# EAGLE design module (EAGLE 7.7.0)
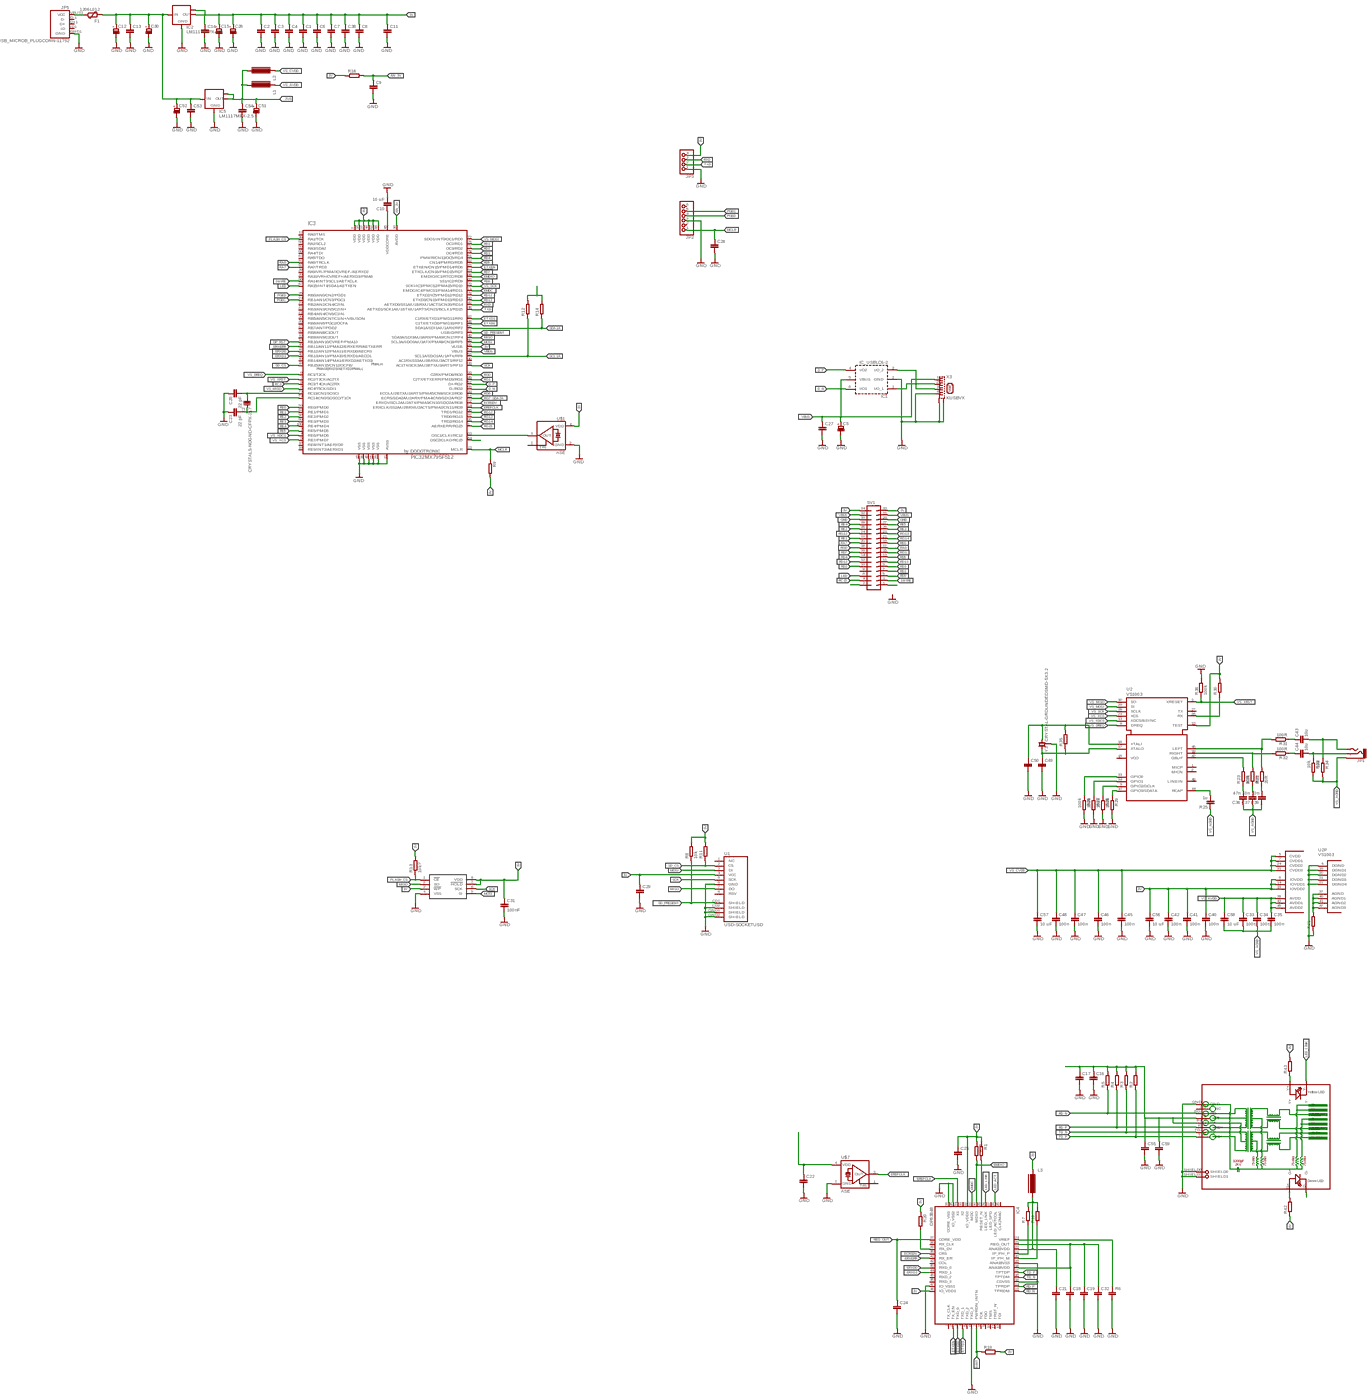
[diagram p0: schematic, sheet 1, overview]
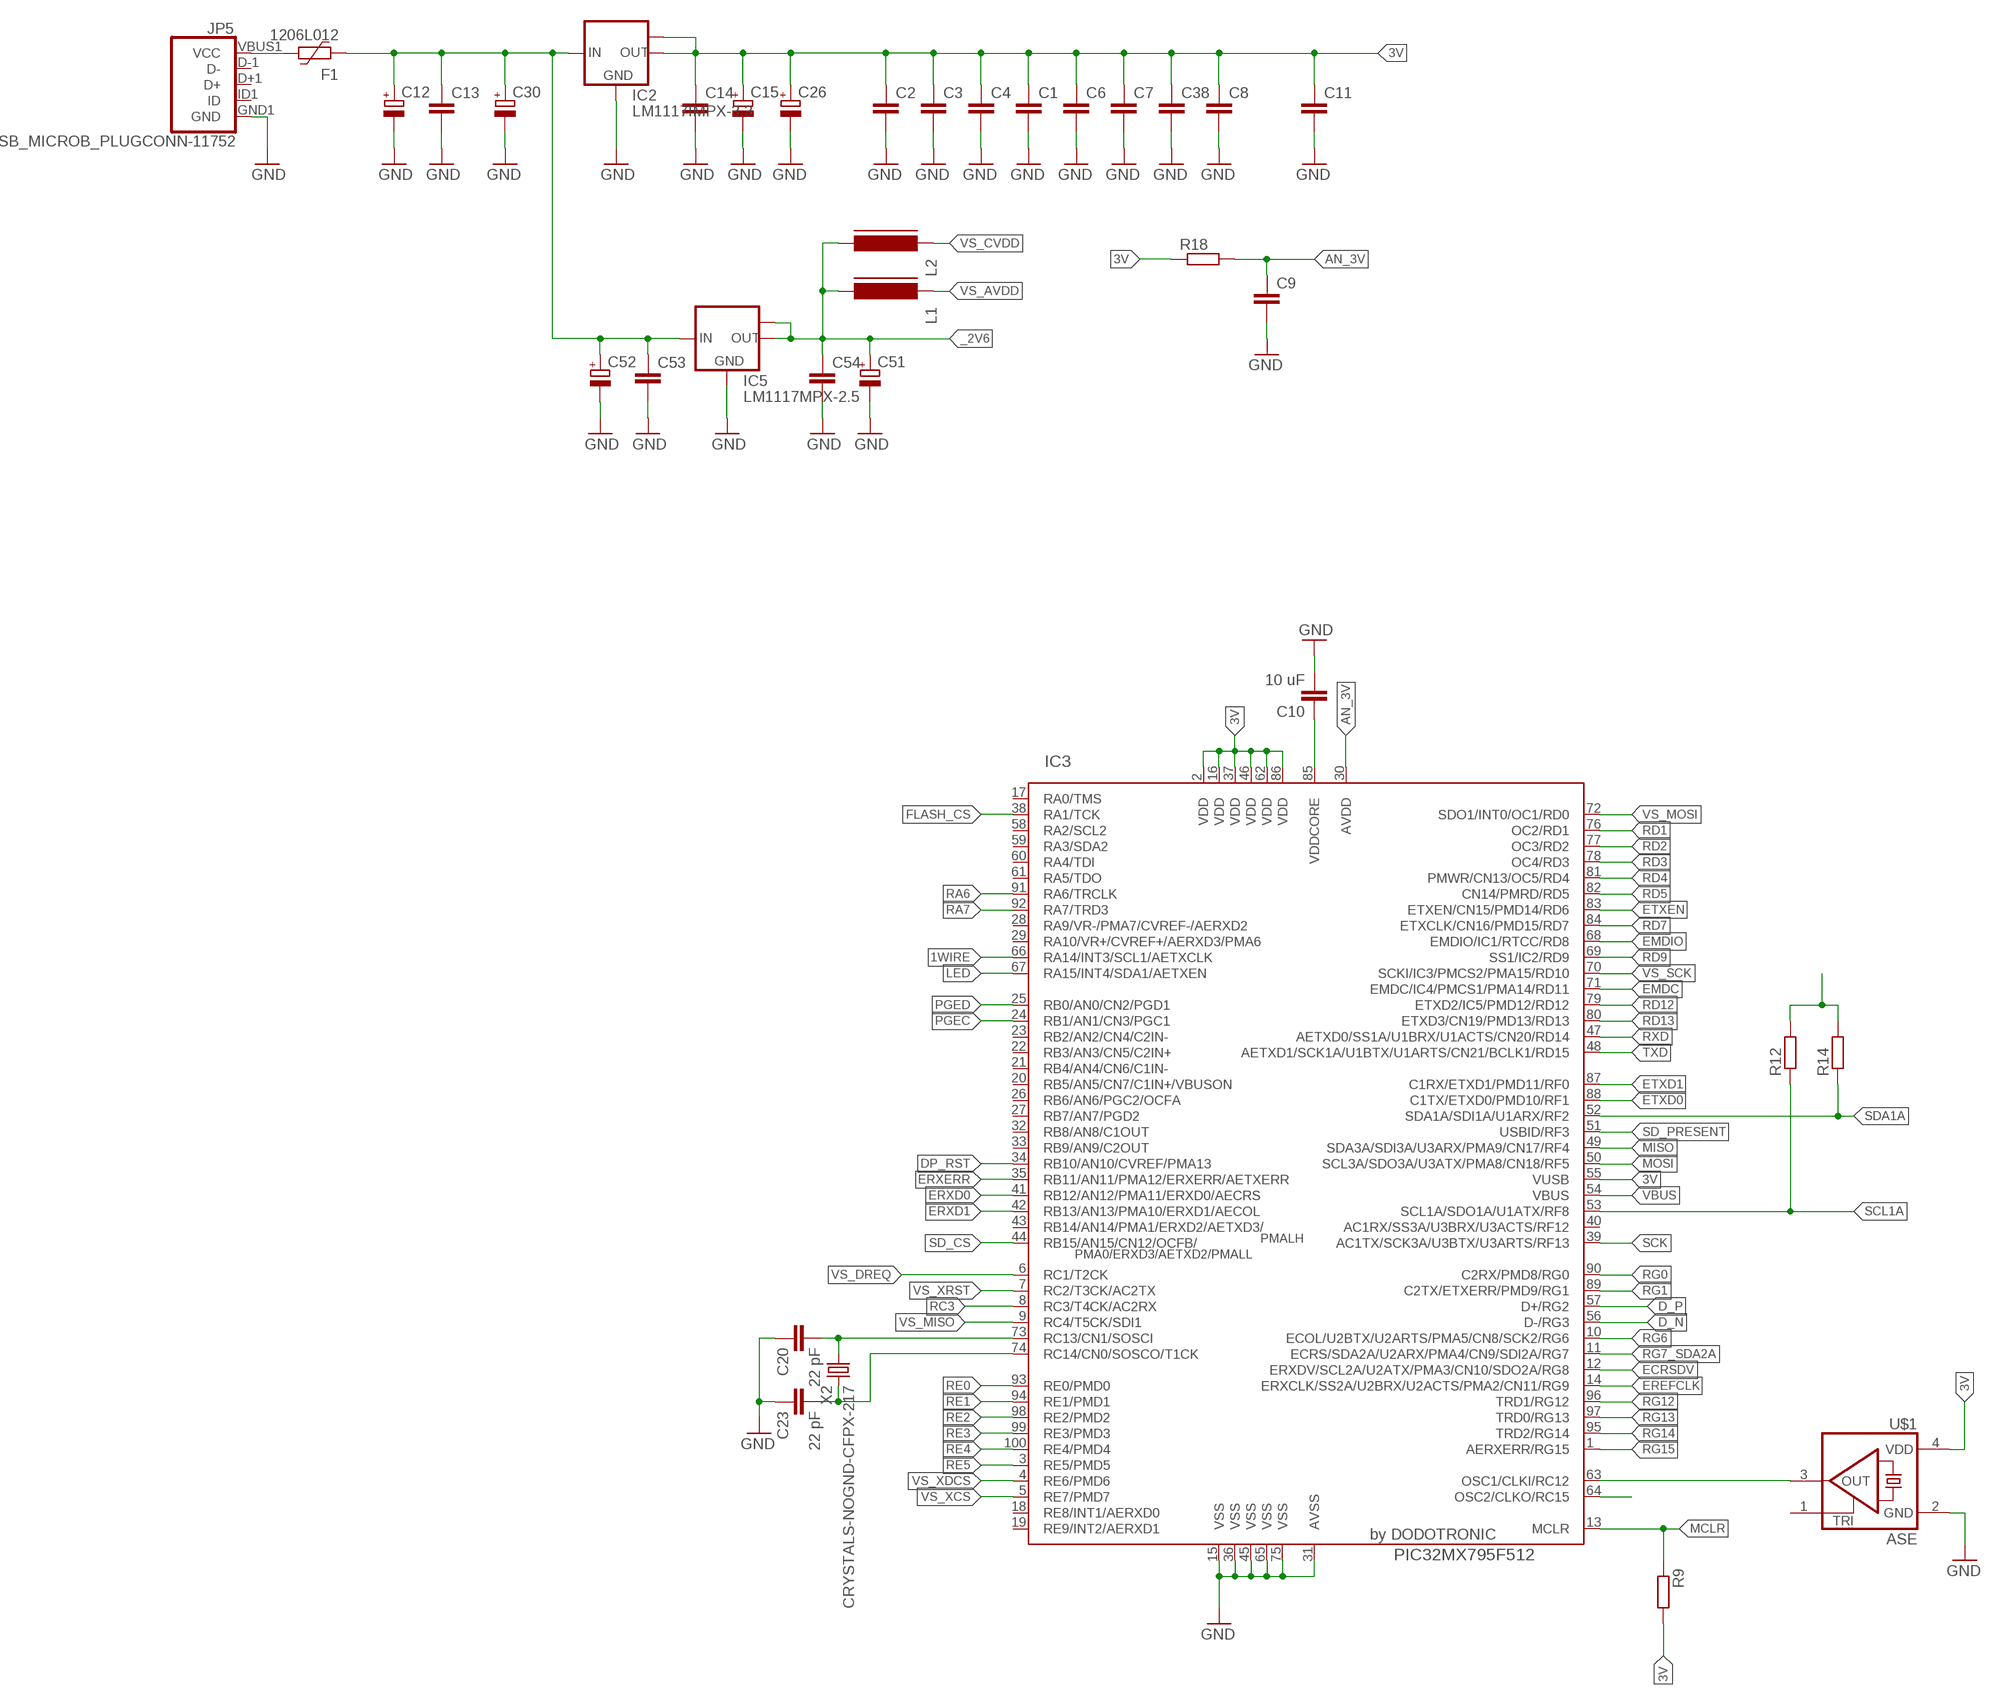
[diagram p1: schematic, sheet 1, part 1 of 4]
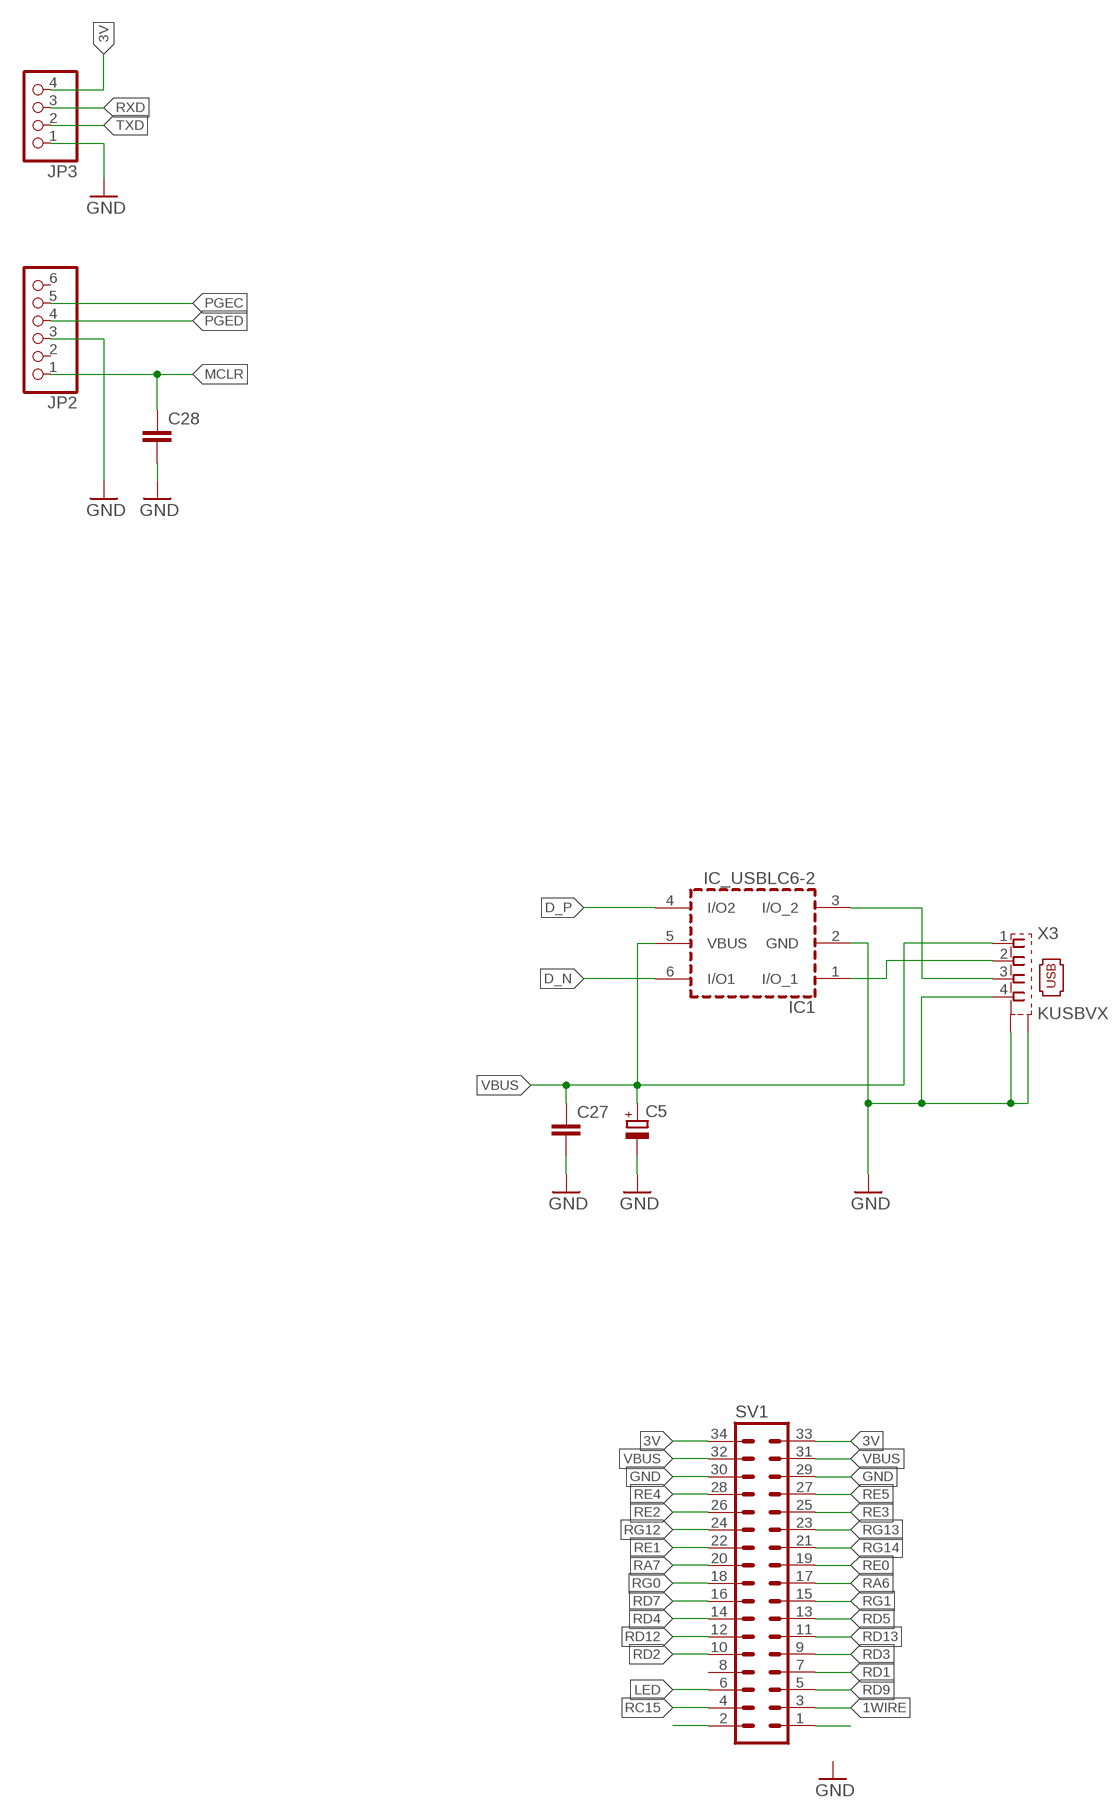
[diagram p2: schematic, sheet 1, part 2 of 4]
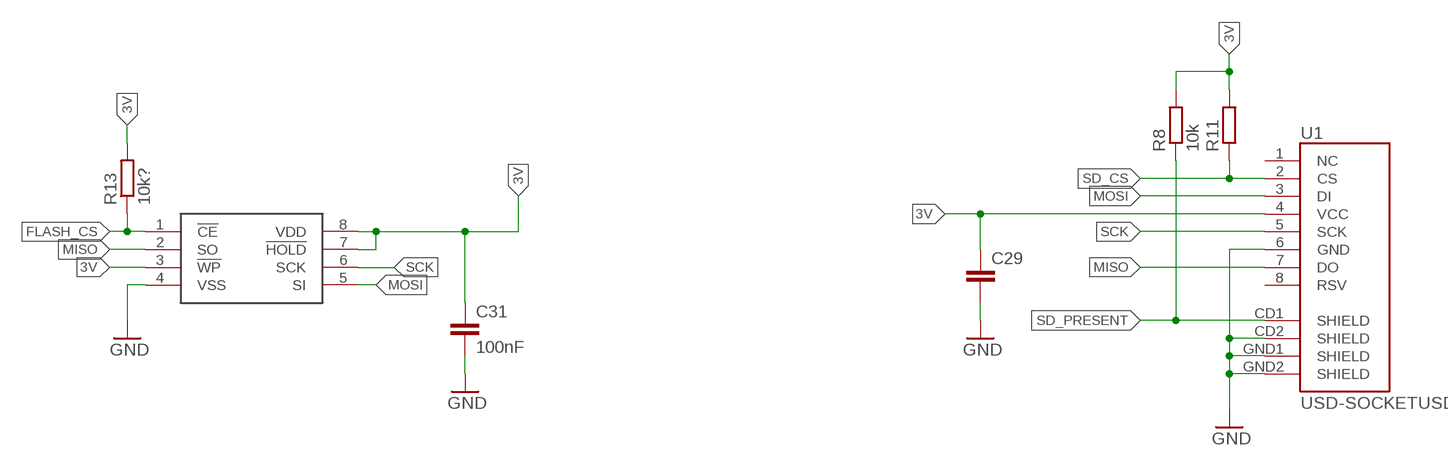
[diagram p3: schematic, sheet 1, part 3 of 4]
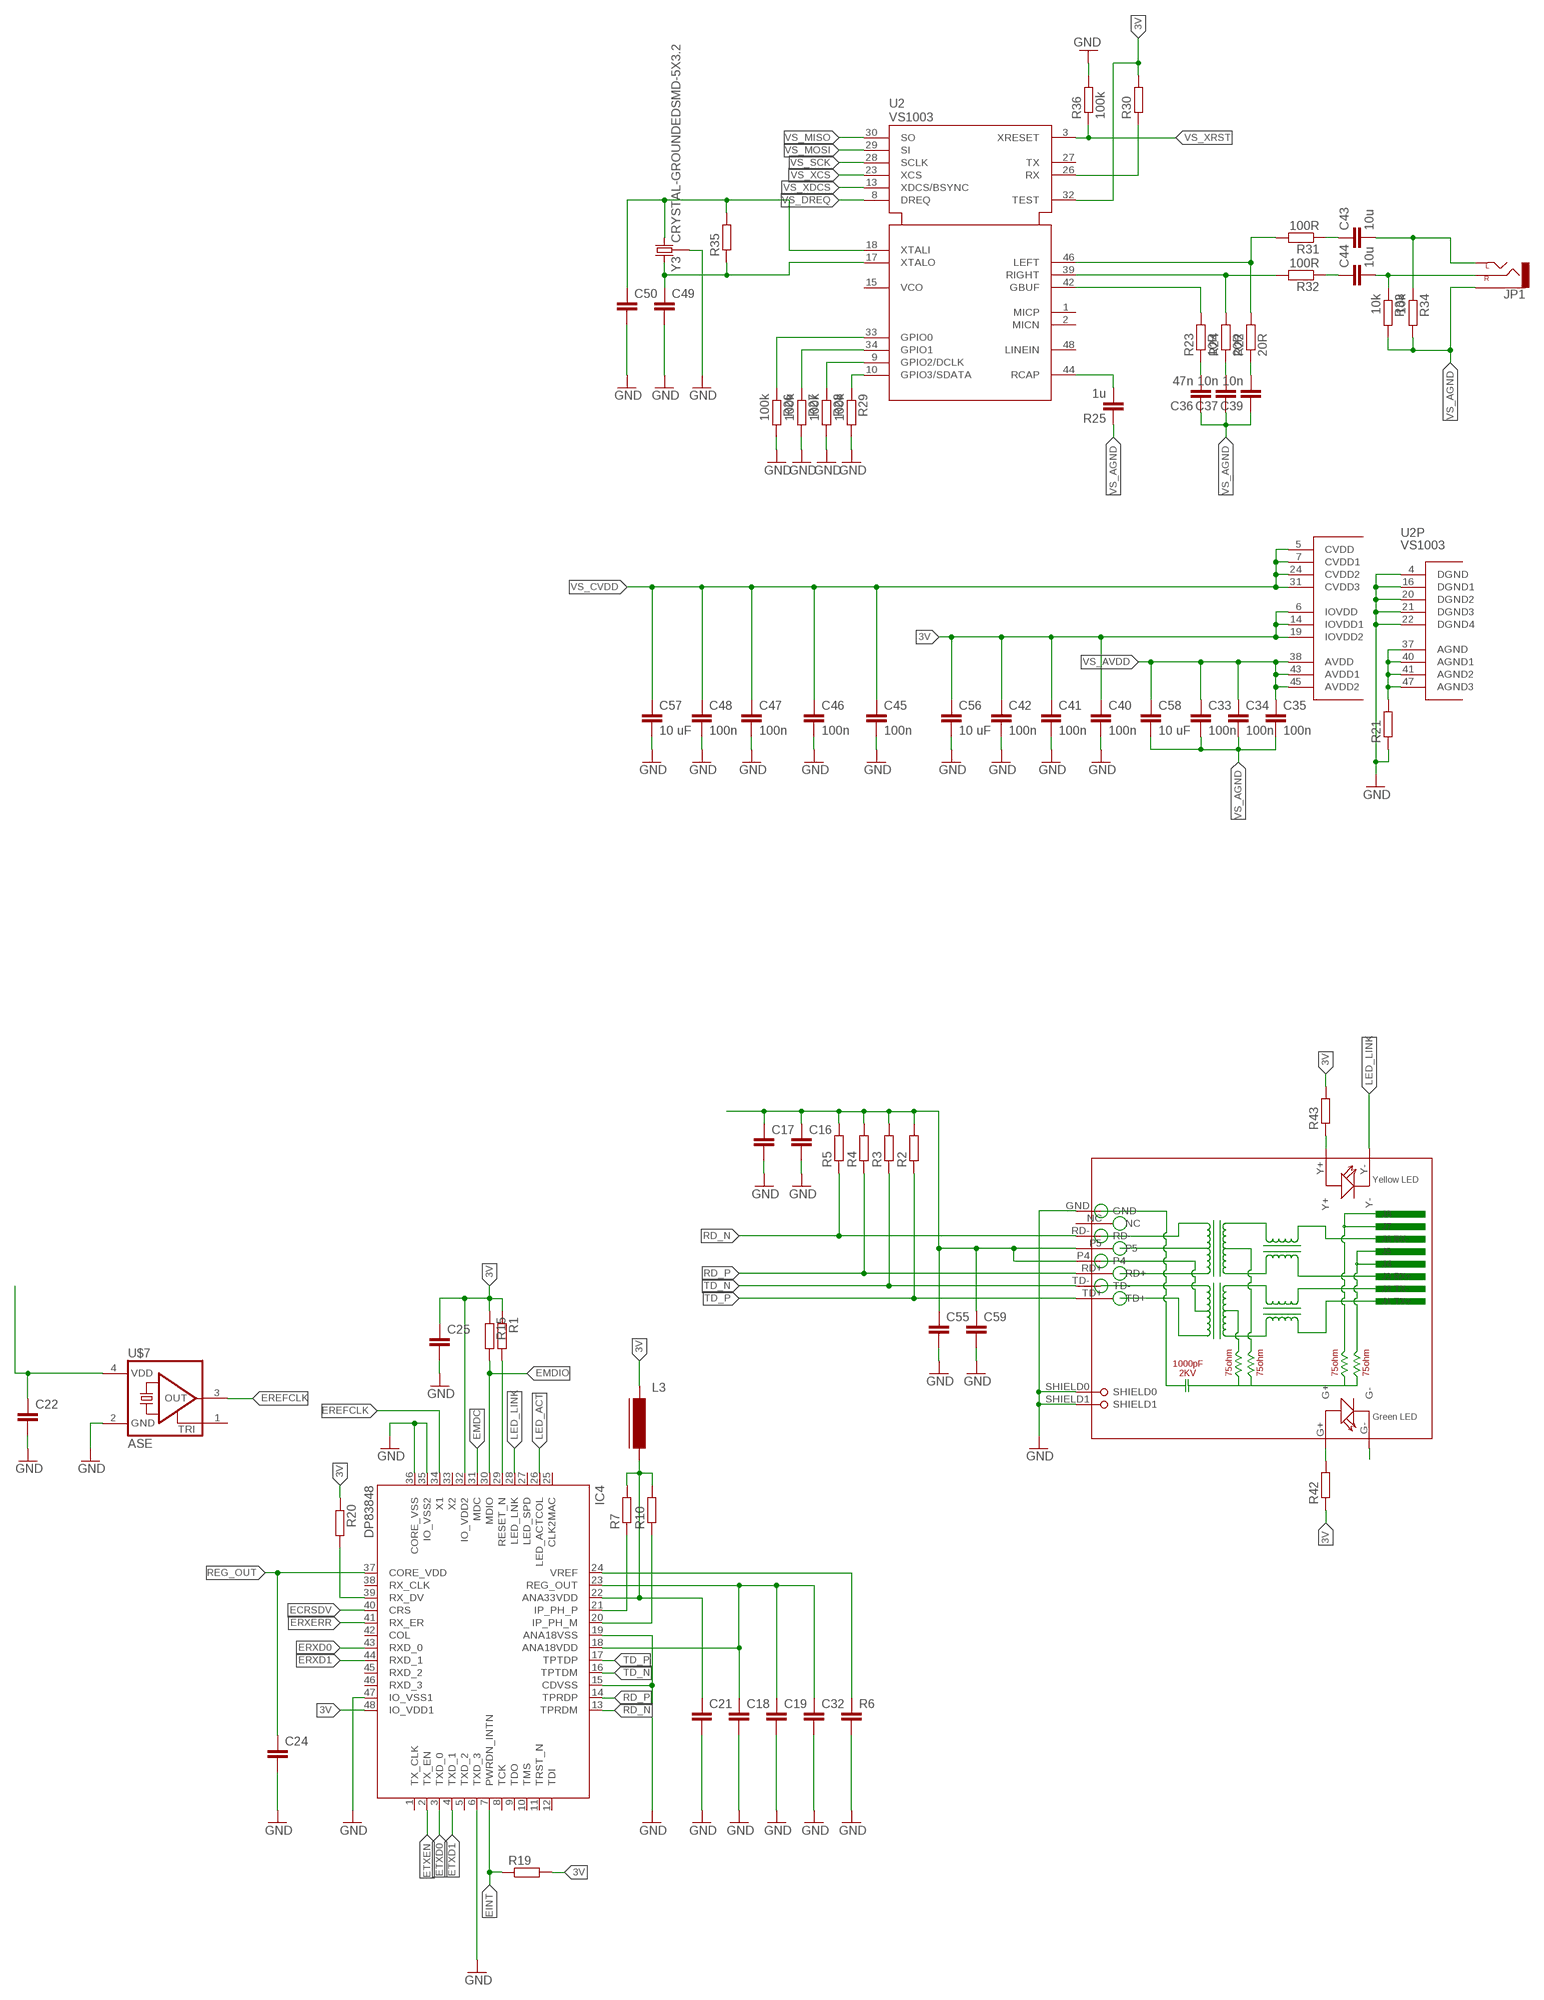
[diagram p4: schematic, sheet 1, part 4 of 4]

## Parts
C1  C-EUC0402  [C0402]
C2  C-EUC0402  [C0402]
C3  C-EUC0402  [C0402]
C4  C-EUC0402  [C0402]
C5  CPOL-EUSMCA  [SMC_A]
C6  C-EUC0402  [C0402]
C7  C-EUC0402  [C0402]
C8  C-EUC0402  [C0402]
C9  C-EUC0402  [C0402]
C10  10 uF  C-EUC0603  [C0603]
C11  C-EUC0402  [C0402]
C12  CPOL-EUSMCB  [SMC_B]
C13  C-EUC0603  [C0603]
C14  C-EUC0603  [C0603]
C15  CPOL-EUSMCB  [SMC_B]
C16  C-EUC0603  [C0603]
C17  C-EUC0603  [C0603]
C18  C-EUC0402  [C0402]
C19  C-EUC0402  [C0402]
C20  22 pF  C-EUC0603  [C0603]
C21  C-EUC0402  [C0402]
C22  C-EUC0402  [C0402]
C23  22 pF  C-EUC0603  [C0603]
C24  C-EUC0603  [C0603]
C25  C-EUC0603  [C0603]
C26  CPOL-EUSMCA  [SMC_A]
C27  C-EUC0603  [C0603]
C28  C-EUC0603  [C0603]
C29  C-EUC0603  [C0603]
C30  CPOL-EUSMCA  [SMC_A]
C31  100nF  C-EUC0603  [C0603]
C32  C-EUC0603  [C0603]
C33  100n  C-EUC0603  [C0603]
C34  100n  C-EUC0603  [C0603]
C35  100n  C-EUC0603  [C0603]
C36  47n  C-EUC0603  [C0603]
C37  10n  C-EUC0603  [C0603]
C38  C-EUC0402  [C0402]
C39  10n  C-EUC0603  [C0603]
C40  100n  C-EUC0402  [C0402]
C41  100n  C-EUC0402  [C0402]
C42  100n  C-EUC0402  [C0402]
C43  10u  C-EUC0603  [C0603]
C44  10u  C-EUC0603  [C0603]
C45  100n  C-EUC0402  [C0402]
C46  100n  C-EUC0603  [C0603]
C47  100n  C-EUC0603  [C0603]
C48  100n  C-EUC0603  [C0603]
C49  C-EUC0603  [C0603]
C50  C-EUC0603  [C0603]
C51  CPOL-EUSMCB  [SMC_B]
C52  CPOL-EUSMCB  [SMC_B]
C53  C-EUC1206  [C1206]
C54  C-EUC1206  [C1206]
C55  C-EUC0603  [C0603]
C56  10 uF  C-EUC0603  [C0603]
C57  10 uF  C-EUC0603  [C0603]
C58  10 uF  C-EUC0603  [C0603]
C59  C-EUC0603  [C0603]
F1  1206L012  [1206L]
IC1  IC_USBLC6-2  [SOT-23-6L]
IC2  LM1117IMPX-3.3  [SOT223]
IC3  PIC32MX795F512  [TQFP100_12X12]
IC4  DP83848  [LQFP48]
IC5  LM1117MPX-2.5  [SOT223]
JP1  AUDIO-JACKAUDIO_JACK2  [AUDIO-JACK2]
JP2  PINHD-1X6  [1X06]
JP3  PINHD-1X4  [1X04]
JP5  USB_MICROB_PLUGCONN-11752  [USB-B-MICRO-SMD_V03]
L1  FERRITE-0805  [FB805]
L2  FERRITE-0805  [FB805]
L3  FERRITE-0805  [FB805]
R1  R-EU_R0402  [R0402]
R2  R-EU_R0603  [R0603]
R3  R-EU_R0603  [R0603]
R4  R-EU_R0603  [R0603]
R5  R-EU_R0603  [R0603]
R6  C-EUC0603  [C0603]
R7  R-EU_R0402  [R0402]
R8  10k  R-EU_R0603  [R0603]
R9  R-EU_R0603  [R0603]
R10  R-EU_R0402  [R0402]
R11  R-EU_R0603  [R0603]
R12  R-EU_R0603  [R0603]
R13  10k?  R-EU_R0603  [R0603]
R14  R-EU_R0402  [R0402]
R15  R-EU_R0603  [R0603]
R18  R-EU_R0805  [R0805]
R19  R-EU_R0402  [R0402]
R20  R-EU_R0603  [R0603]
R21  R-EU_R0603  [R0603]
R22  20R  R-EU_R0603  [R0603]
R23  10R  R-EU_R0603  [R0603]
R24  20R  R-EU_R0603  [R0603]
R25  1u  C-EUC0603  [C0603]
R26  100k  R-EU_R0402  [R0402]
R27  100k  R-EU_R0402  [R0402]
R28  100k  R-EU_R0402  [R0402]
R29  100k  R-EU_R0402  [R0402]
R30  R-EU_0204/7  [0204/7]
R31  100R  R-EU_R0603  [R0603]
R32  100R  R-EU_R0603  [R0603]
R33  10k  R-EU_R0603  [R0603]
R34  10k  R-EU_R0603  [R0603]
R35  R-EU_R0603  [R0603]
R36  100k  R-EU_R0603  [R0603]
R42  R-EU_R0603  [R0603]
R43  R-EU_R0603  [R0603]
RJ1  HR911105A  [HR911105A]
SV1  ML34L  [ML34L]
U1  USD-SOCKETUSD  [USD-SOCKET-PP]
U2  VS1003  [LQFP48]
U$1  ASE  [ASE]
U$2  SST25VF016BSO8M  [SO-08M]
U$7  ASE  [ASE]
X2  CRYSTALS-NOGND-CFPX-217  [3.2X1.5-2-PAD]
X3  KUSBVX  [KUSBVX]
Y3  CRYSTAL-GROUNDEDSMD-5X3.2  [CRYSTAL-SMD-5X3.2-4PAD]

## Nets
1WIRE: IC3.66(RA14/INT3/SCL1/AETXCLK) SV1.3
3V: C1.1 C2.1 C3.1 C4.1 C6.1 C7.1 C8.1 C11.1 C14.1 C15.+ C22.1 C25.1 C26.+ C29.1 C31.1 C38.1 C40.1 C41.1 C42.1 C56.1 IC2.2(OUT) IC2.TAB(OUT1) IC3.2(VDD) IC3.16(VDD) IC3.37(VDD) IC3.46(VDD) IC3.55(VUSB) IC3.62(VDD) IC3.86(VDD) IC4.32(IO_VDD2) IC4.48(IO_VDD1) JP3.4 L3.1 R1.1 R8.2 R9.2 R11.2 R12.2 R13.2 R14.2 R15.1 R18.1 R19.2 R20.1 R30.2 R42.1 R43.2 SV1.33 SV1.34 U1.4(VCC) U2.6(IOVDD) U2.14(IOVDD1) U2.19(IOVDD2) U2.32(TEST) U$1.4(VDD) U$2.3(!WP) U$2.7(!HOLD) U$2.8(VDD) U$7.4(VDD)
_2V6: C51.+ C54.1 IC5.2(OUT) IC5.TAB(OUT1) L1.2 L2.2
A3V: C16.1 C17.1 C21.1 C55.1 C59.1 IC4.22(ANA33VDD) L3.2 R2.2 R3.2 R4.2 R5.2 R7.2 R10.2 RJ1.P4 RJ1.P5
AN_3V: C9.1 IC3.30(AVDD) R18.2
D2_N: IC1.1(I/O_1) X3.2
D2_P: IC1.3(I/O_2) X3.3
D_N: IC1.6(I/O1) IC3.56(D-/RG3)
D_P: IC1.4(I/O2) IC3.57(D+/RG2)
DP_RST: IC3.34(RB10/AN10/CVREF/PMA13) IC4.29(RESET_N) R1.2
ECRSDV: IC3.12(ERXDV/SCL2A/U2ATX/PMA3/CN10/SDO2A/RG8) IC4.40(CRS)
EINT: IC4.7(PWRDN_INTN) R19.1
EMDC: IC3.71(EMDC/IC4/PMCS1/PMA14/RD11) IC4.31(MDC)
EMDIO: IC3.68(EMDIO/IC1/RTCC/RD8) IC4.30(MDIO) R15.2
EREFCLK: IC3.14(ERXCLK/SS2A/U2BRX/U2ACTS/PMA2/CN11/RG9) IC4.34(X1) U$7.3(OUT)
ERXD0: IC3.41(RB12/AN12/PMA11/ERXD0/AECRS) IC4.43(RXD_0)
ERXD1: IC3.42(RB13/AN13/PMA10/ERXD1/AECOL) IC4.44(RXD_1)
ERXERR: IC3.35(RB11/AN11/PMA12/ERXERR/AETXERR) IC4.41(RX_ER)
ETXD0: IC3.88(C1TX/ETXD0/PMD10/RF1) IC4.3(TXD_0)
ETXD1: IC3.87(C1RX/ETXD1/PMD11/RF0) IC4.4(TXD_1)
ETXEN: IC3.83(ETXEN/CN15/PMD14/RD6) IC4.2(TX_EN)
FLASH_CS: IC3.38(RA1/TCK) R13.1 U$2.1(!CE)
GND: C1.2 C2.2 C3.2 C4.2 C5.- C6.2 C7.2 C8.2 C9.2 C10.2 C11.2 C12.- C13.2 C14.2 C15.- C16.2 C17.2 C18.2 C19.2 C20.1 C21.2 C22.2 C23.1 C24.2 C25.2 C26.- C27.2 C28.2 C29.2 C30.- C31.2 C32.2 C38.2 C40.2 C41.2 C42.2 C45.2 C46.2 C47.2 C48.2 C49.2 C50.2 C51.- C52.- C53.2 C54.2 C55.2 C56.2 C57.2 C59.2 IC1.2(GND) IC2.1(GND) IC3.15(VSS) IC3.31(AVSS) IC3.36(VSS) IC3.45(VSS) IC3.65(VSS) IC3.75(VSS) IC4.6(TXD_3) IC4.15(CDVSS) IC4.19(ANA18VSS) IC4.35(IO_VSS2) IC4.36(CORE_VSS) IC4.47(IO_VSS1) IC5.1(GND) JP2.3 JP3.1 JP5.GND1(GND) R6.2 R21.1 R26.2 R27.2 R28.2 R29.2 R36.2 RJ1.GND RJ1.SHIELD0 RJ1.SHIELD1 SV1.29 SV1.30 U1.6(GND) U1.CD2(SHIELD) U1.GND1(SHIELD) U1.GND2(SHIELD) U2.4(DGND) U2.16(DGND1) U2.20(DGND2) U2.21(DGND3) U2.22(DGND4) U$1.2(GND) U$2.4(VSS) U$7.2(GND) X3.4 X3.M1(S1) X3.M2(S2) Y3.2 Y3.4
LED: IC3.67(RA15/INT4/SDA1/AETXEN) SV1.6
LED_ACT: IC4.26(LED_ACTCOL) RJ1.G-
LED_LINK: IC4.28(LED_LNK) RJ1.Y-
MCLR: C28.1 IC3.13(MCLR) JP2.1 R9.1
MISO: IC3.49(SDA3A/SDI3A/U3ARX/PMA9/CN17/RF4) U1.7(DO) U$2.2(SO)
MOSI: IC3.50(SCL3A/SDO3A/U3ATX/PMA8/CN18/RF5) U1.3(DI) U$2.5(SI)
N$1: IC4.21(IP_PH_P) R7.1
N$3: IC4.24(VREF) R6.1
N$6: IC4.20(IP_PH_M) R10.1
N$10: C10.1 IC3.85(VDDCORE)
N$12: R42.2 RJ1.G+
N$17: F1.1 JP5.VBUS1(VCC)
N$18: C36.2 R23.1
N$19: R43.1 RJ1.Y+
PGEC: IC3.24(RB1/AN1/CN3/PGC1) JP2.5
PGED: IC3.25(RB0/AN0/CN2/PGD1) JP2.4
PH0: IC3.63(OSC1/CLKI/RC12) U$1.3(OUT)
RA6: IC3.91(RA6/TRCLK) SV1.17
RA7: IC3.92(RA7/TRD3) SV1.20
RC3: IC3.8(RC3/T4CK/AC2RX)
RC15: IC3.64(OSC2/CLKO/RC15) SV1.4
RD1: IC3.76(OC2/RD1) SV1.7
RD2: IC3.77(OC3/RD2) SV1.10
RD3: IC3.78(OC4/RD3) SV1.9
RD4: IC3.81(PMWR/CN13/OC5/RD4) SV1.14
RD5: IC3.82(CN14/PMRD/RD5) SV1.13
RD7: IC3.84(ETXCLK/CN16/PMD15/RD7) SV1.16
RD9: IC3.69(SS1/IC2/RD9) SV1.5
RD12: IC3.79(ETXD2/IC5/PMD12/RD12) SV1.12
RD13: IC3.80(ETXD3/CN19/PMD13/RD13) SV1.11
RD_N: IC4.13(TPRDM) R5.1 RJ1.RD-
RD_P: IC4.14(TPRDP) R4.1 RJ1.RD+
RE0: IC3.93(RE0/PMD0) SV1.19
RE1: IC3.94(RE1/PMD1) SV1.22
RE2: IC3.98(RE2/PMD2) SV1.26
RE3: IC3.99(RE3/PMD3) SV1.25
RE4: IC3.100(RE4/PMD4) SV1.28
RE5: IC3.3(RE5/PMD5) SV1.27
REG_OUT: C18.1 C19.1 C24.1 C32.1 IC4.18(ANA18VDD) IC4.23(REG_OUT) IC4.37(CORE_VDD)
RG0: IC3.90(C2RX/PMD8/RG0) SV1.18
RG1: IC3.89(C2TX/ETXERR/PMD9/RG1) SV1.15
RG6: IC3.10(ECOL/U2BTX/U2ARTS/PMA5/CN8/SCK2/RG6)
RG7_SDA2A: IC3.11(ECRS/SDA2A/U2ARX/PMA4/CN9/SDI2A/RG7)
RG12: IC3.96(TRD1/RG12) SV1.24
RG13: IC3.97(TRD0/RG13) SV1.23
RG14: IC3.95(TRD2/RG14) SV1.21
RG15: IC3.1(AERXERR/RG15)
RX_DV: IC4.39(RX_DV) R20.2
RXD: IC3.47(AETXD0/SS1A/U1BRX/U1ACTS/CN20/RD14) JP3.3
SCK: IC3.39(AC1TX/SCK3A/U3BTX/U3ARTS/RF13) U1.5(SCK) U$2.6(SCK)
SCL1A: IC3.53(SCL1A/SDO1A/U1ATX/RF8) R12.1 SV1.1
SD_CS: IC3.44(RB15/AN15/CN12/OCFB/) R11.1 U1.2(CS)
SD_PRESENT: IC3.51(USBID/RF3) R8.1 U1.CD1(SHIELD)
SDA1A: IC3.52(SDA1A/SDI1A/U1ARX/RF2) R14.1 SV1.2
SOSCI: C20.2 IC3.73(RC13/CN1/SOSCI) X2.1
SOSCO: C23.2 IC3.74(RC14/CN0/SOSCO/T1CK) X2.2
TD_N: IC4.16(TPTDM) R3.1 RJ1.TD-
TD_P: IC4.17(TPTDP) R2.1 RJ1.TD+
TXD: IC3.48(AETXD1/SCK1A/U1BTX/U1ARTS/CN21/BCLK1/RD15) JP3.2
VBUS: C5.+ C12.+ C13.1 C27.1 C30.+ C52.+ C53.1 F1.2 IC1.5(VBUS) IC2.3(IN) IC3.54(VBUS) IC5.3(IN) SV1.31 SV1.32 X3.1
VS_AGND: C33.2 C34.2 C35.2 C36.1 C37.1 C39.1 C58.2 JP1.SLEEVE R21.2 R25.1 R33.2 R34.2 U2.37(AGND) U2.40(AGND1) U2.41(AGND2) U2.47(AGND3)
VS_AVDD: C33.1 C34.1 C35.1 C58.1 L1.1 U2.38(AVDD) U2.43(AVDD1) U2.45(AVDD2)
VS_CVDD: C45.1 C46.1 C47.1 C48.1 C57.1 L2.1 U2.5(CVDD) U2.7(CVDD1) U2.24(CVDD2) U2.31(CVDD3)
VS_DREQ: IC3.6(RC1/T2CK) U2.8(DREQ)
VS_MISO: IC3.9(RC4/T5CK/SDI1) U2.30(SO)
VS_MOSI: IC3.72(SDO1/INT0/OC1/RD0) U2.29(SI)
VS_N$9: C50.1 R35.2 U2.18(XTALI) Y3.1
VS_N$13: C49.1 R35.1 U2.17(XTALO) Y3.3
VS_N$14: R22.2 R31.2 U2.46(LEFT)
VS_N$15: R23.2 U2.42(GBUF)
VS_N$16: R24.2 R32.2 U2.39(RIGHT)
VS_N$17: R25.2 U2.44(RCAP)
VS_N$24: C37.2 R24.1
VS_N$25: C39.2 R22.1
VS_N$26: R29.1 U2.10(GPIO3/SDATA)
VS_N$27: R28.1 U2.9(GPIO2/DCLK)
VS_N$28: R27.1 U2.34(GPIO1)
VS_N$30: R26.1 U2.33(GPIO0)
VS_N$34: R30.1 U2.26(RX)
VS_N$35: C43.1 R31.1
VS_N$36: C44.1 R32.1
VS_N$37: C44.2 JP1.RING(RIGHT) R33.1
VS_N$38: C43.2 JP1.TIP(LEFT) R34.1
VS_SCK: IC3.70(SCKI/IC3/PMCS2/PMA15/RD10) U2.28(SCLK)
VS_XCS: IC3.5(RE7/PMD7) U2.23(XCS)
VS_XDCS: IC3.4(RE6/PMD6) U2.13(XDCS/BSYNC)
VS_XRST: IC3.7(RC2/T3CK/AC2TX) R36.1 U2.3(XRESET)
Unconnected: IC3.17(RA0/TMS) IC3.18(RE8/INT1/AERXD0) IC3.19(RE9/INT2/AERXD1) IC3.20(RB5/AN5/CN7/C1IN+/VBUSON) IC3.21(RB4/AN4/CN6/C1IN-) IC3.22(RB3/AN3/CN5/C2IN+) IC3.23(RB2/AN2/CN4/C2IN-) IC3.26(RB6/AN6/PGC2/OCFA) IC3.27(RB7/AN7/PGD2) IC3.28(RA9/VR-/PMA7/CVREF-/AERXD2) IC3.29(RA10/VR+/CVREF+/AERXD3/PMA6) IC3.32(RB8/AN8/C1OUT) IC3.33(RB9/AN9/C2OUT) IC3.40(AC1RX/SS3A/U3BRX/U3ACTS/RF12) IC3.43(RB14/AN14/PMA1/ERXD2/AETXD3/) IC3.58(RA2/SCL2) IC3.59(RA3/SDA2) IC3.60(RA4/TDI) IC3.61(RA5/TDO) IC4.1(TX_CLK) IC4.5(TXD_2) IC4.8(TCK) IC4.9(TDO) IC4.10(TMS) IC4.11(TRST_N) IC4.12(TDI) IC4.25(CLK2MAC) IC4.27(LED_SPD) IC4.33(X2) IC4.38(RX_CLK) IC4.42(COL) IC4.45(RXD_2) IC4.46(RXD_3) JP2.2 JP2.6 JP5.D+1(D+) JP5.D-1(D-) JP5.ID1(ID) RJ1.NC SV1.8 U1.1(NC) U1.8(RSV) U2.1(MICP) U2.2(MICN) U2.15(VCO) U2.27(TX) U2.48(LINEIN) U$1.1(TRI) U$7.1(TRI)

## Library data of the parts
C1-C4 C6-C11 C13 C14 C16-C25 C27-C29 C31-C50 C53-C59 R6 R25 = rcl:C-EU: CAPACITOR, European symbol
C5 C12 C15 C26 C30 C51 C52 = rcl:CPOL-EU: POLARIZED CAPACITOR, European symbol
F1 = polyfuse-smd_10:?: Polyfuse Resettable PTC Source: http://www.littelfuse.com/products/resettable-ptcs.aspx; MF: Littelfuse; MPN: 1206L012; OC_FARNELL: 1596988; OC_NEWARK: 05M2298
IC1 = dp_devices:IC_USBLC6-2
IC2 = lm1117:LM1117IMPX-*
IC3 = DodoMicroR3:PIC32MX795F512: USB, CAN and Ethernet 32-bit Flash Microcontroller
IC4 = national-semiconductor:DP83848: PHYTER® - Extended Temperature Single Port 10/100 Mb/s Ethernet Physical Layer Transceiver Auto generated by make-symbol-device-package-bsdl.ulp Rev. 34 Source: dp83848yb.bsdl http://www.national.com/ds/DP/DP83848VYB.pdf; MPN: DP83848VYB; OC_FARNELL: 1286817; OC_NEWARK: 11N4484
IC5 = lm1117:LM1117MPX-*
JP1 = SparkFun-Connectors:AUDIO-JACK: 3.5mm Audio Jack Simple 3.5mm common PCB mount audio jack. SKU: PRT-08032
JP2 = pinhead:PINHD-1X6: PIN HEADER
JP3 = pinhead:PINHD-1X4: PIN HEADER
JP5 = SparkFun-Connectors:USB_MICROB_PLUG: USB Micro-B connectors Some male, some female. Watch your step!; PROD_ID: CONN-11752
L1-L3 = dp_devices:FERRITE: Ferrite bead in various packages
R1-R5 R7-R15 R18-R24 R26-R36 R42 R43 = rcl:R-EU_: RESISTOR, European symbol
RJ1 = hanrun:HR911105A
SV1 = con-harting-ml:ML34: HARTING; OC_FARNELL: unknown; OC_NEWARK: unknown
U1 = SparkFun-Connectors:USD-SOCKET: microSD Socket Push-push type uSD socket. Schematic element and footprint production proven. Spark Fun Electronics SKU : PRT-00127. tDoc lines correctly indicate media card edge positions when inserting (unlocked, locked, depressed).
U2 = vlsi-web:VS1003: MP3 / WMA / MIDI Audio Codec Circuit
U$1 U$7 = crystal:ASE: 3.3Vdc CMOS SMD CRYSTAL CLOCK OSCILLATOR SOurce: www.abracon.com; OC_FARNELL: unknown; OC_NEWARK: unknown
U$2 = mw:SST25VF016B
X2 = IQD-Frequency-Products:CRYSTALS-NOGND: CRYSTALS CAN NOT GROUNDED
X3 = con-kycon:KUSBVX: Vertical,Top Entry Universal Serial Bus Connector KUSBVX Series Source: KYCON Sibalco USB vertical socket KUSBV.pdf
Y3 = SparkFun-Clocks:CRYSTAL-GROUNDED: Crystals w/ Ground Pin (Generic) These are passive quartz crystals, which can be used as a clock source for a microcontroller. Crystal's are usually two-terminal devices. A third terminal may be optionally connected to ground, as recommended by the manufaturer.

## Board
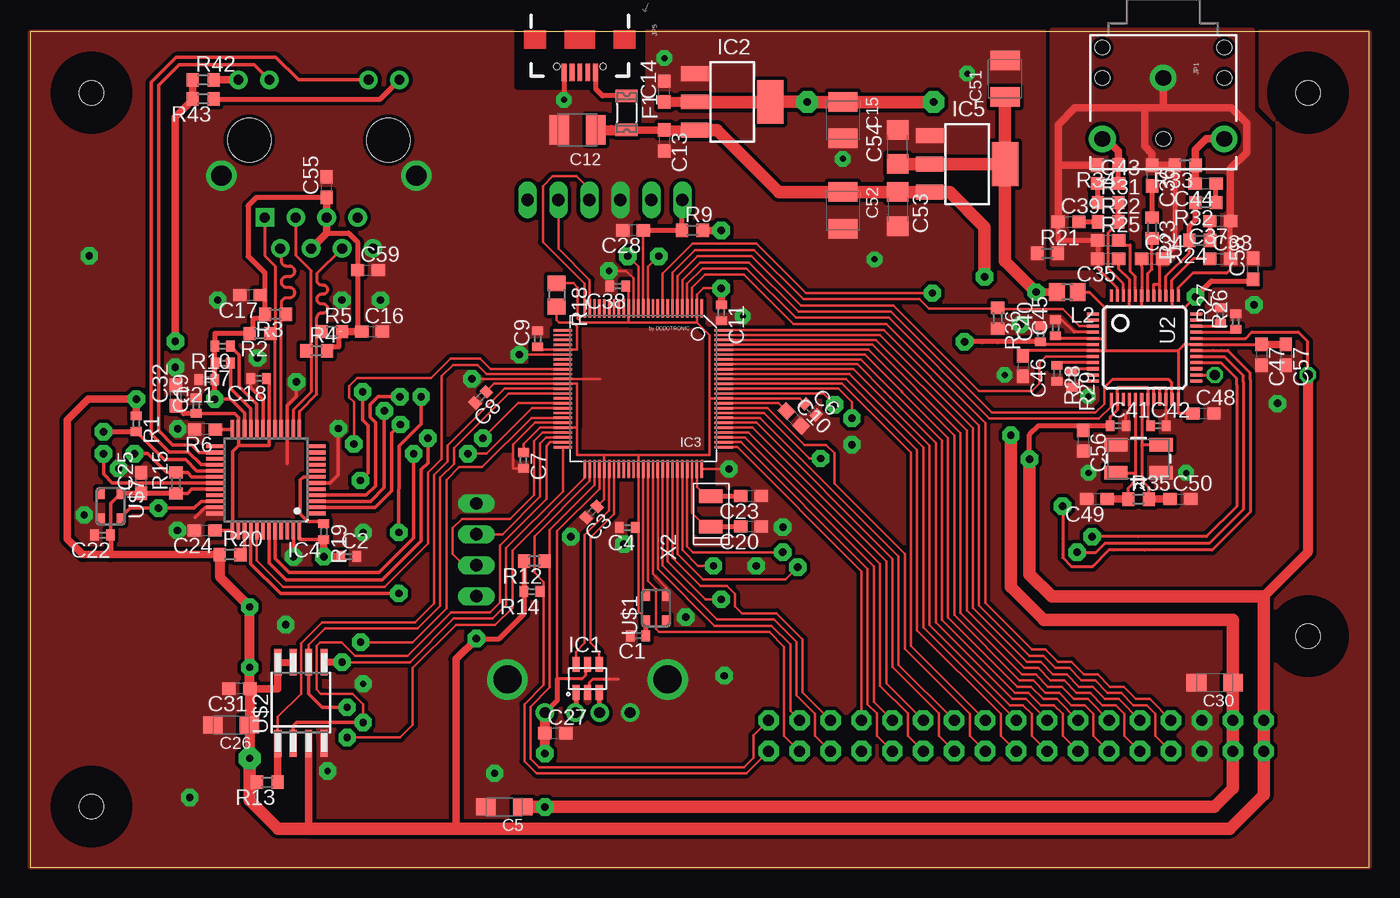
[diagram p5: board, top side]
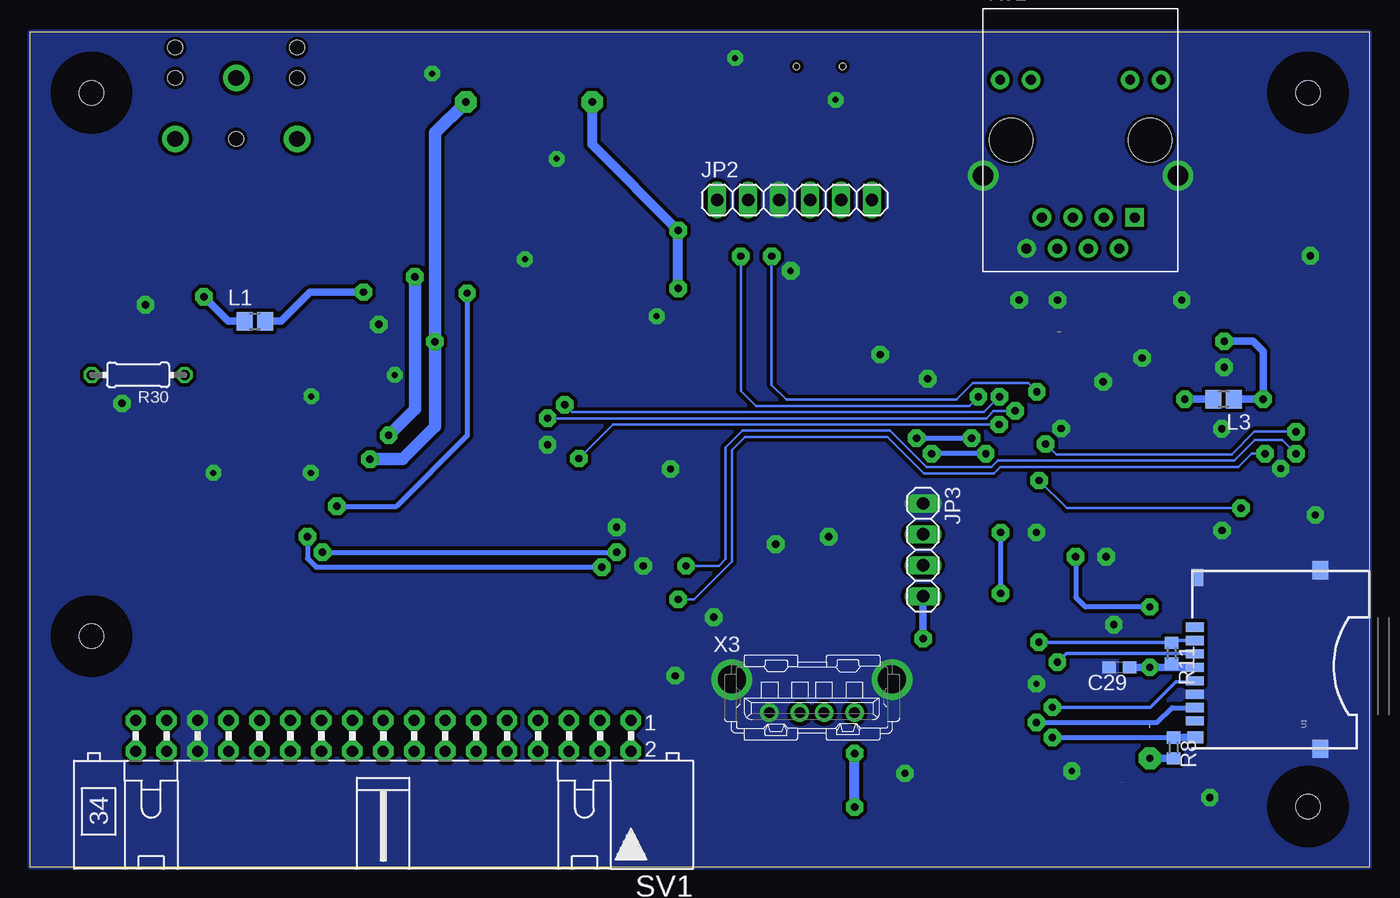
[diagram p6: board, bottom side, seen from below]

Size 109.86 x 68.58 mm. Coordinates in mm from the lower left corner, seen from the top.
Outline: 0,0 109.86,0 109.86,68.58 0,68.58 0,0
Copper layers (1*16): Top 0.035mm / dielectric 1.5mm / Bottom 0.035mm
Design rules "default *": minimum track width 10mil, minimum drill 24mil, track to track 8mil, track to pad 8mil, pad to pad 8mil, via to via 8mil, smd to smd 8mil, copper to edge 0mil, drill to drill 8mil, minimum pad ring 10mil, minimum via ring 8mil, stop-mask expansion 4mil, vias tented up to drill 0mil, thermal gap 10mil
Holes 2 mm at 5,5 104.86,18.97 104.86,63.58 5,63.58
tRestrict: area 55.1,31.1 to 55.9,33.9; area 44.5,14.6 to 47,16.5; area 48,61 to 49.8,62.8; area 40,64.1 to 50.2,68.6; area 2,2 to 8,8; area 101.8,15.9 to 107.9,22; area 101.8,60.5 to 107.9,66.6; area 2,60.5 to 8,66.6; area 88.5,46.4 to 94.3,47.4; area 86.7,39.8 to 87.7,45.6; area 95.2,39.8 to 96.2,45.6; area 88.5,37.9 to 94.3,39.8; 4 more areas
bRestrict: area 2,2 to 8,8; area 101.8,15.9 to 107.9,22; area 101.8,60.5 to 107.9,66.6; area 2,60.5 to 8,66.6

### Footprints (pad centres in the part's own frame; a part is rotated, then mirrored left to right if it is on the bottom)
C0402 = smd 0.7 x 0.9: 1 -0.65,0; 2 0.65,0
SMC_A = smd 1.6 x 1.4: + -1.5,0; - 1.5,0
C0603 = smd 1.1 x 1: 1 -0.85,0; 2 0.85,0
SMC_B = smd 1.6 x 2.4: + -1.5,0; - 1.5,0
C1206 = smd 1.6 x 1.8: 1 -1.4,0; 2 1.4,0
1206L = smd 1 x 1.8: 1 -1.4,0; 2 1.4,0
SOT-23-6L = smd 0.6 x 1.2: 1 -0.95,-2.3; 2 0,-2.3; 3 0.95,-2.3; 4 0.95,0; 5 0,0; 6 -0.95,0
SOT223 = smd 1.219 x 2.235: 1 -2.311,-3.099; 2 0,-3.099; 3 2.311,-3.099 | smd 3.6 x 2.2: TAB 0,3.099
TQFP100_12X12 = smd 0.2 x 1.5: 1 -4.8,-6.6; 2 -4.4,-6.6; 3 -4,-6.6; 4 -3.6,-6.6; 5 -3.2,-6.6; 6 -2.8,-6.6; 7 -2.4,-6.6; 8 -2,-6.6; 9 -1.6,-6.6; 10 -1.2,-6.6; 11 -0.8,-6.6; 12 -0.4,-6.6; 13 0,-6.6; 14 0.4,-6.6; 15 0.8,-6.6; 16 1.2,-6.6; 17 1.6,-6.6; 18 2,-6.6; 19 2.4,-6.6; 20 2.8,-6.6; 21 3.2,-6.6; 22 3.6,-6.6; 23 4,-6.6; 24 4.4,-6.6; 25 4.8,-6.6; 51 4.8,6.6; 52 4.4,6.6; 53 4,6.6; 54 3.6,6.6; 55 3.2,6.6; 56 2.8,6.6; 57 2.4,6.6; 58 2,6.6; 59 1.6,6.6; 60 1.2,6.6; 61 0.8,6.6; 62 0.4,6.6; 63 0,6.6; 64 -0.4,6.6; 65 -0.8,6.6; 66 -1.2,6.6; 67 -1.6,6.6; 68 -2,6.6; 69 -2.4,6.6; 70 -2.8,6.6; 71 -3.2,6.6; 72 -3.6,6.6; 73 -4,6.6; 74 -4.4,6.6; 75 -4.8,6.6 | smd 1.5 x 0.2: 26 6.6,-4.8; 27 6.6,-4.4; 28 6.6,-4; 29 6.6,-3.6; 30 6.6,-3.2; 31 6.6,-2.8; 32 6.6,-2.4; 33 6.6,-2; 34 6.6,-1.6; 35 6.6,-1.2; 36 6.6,-0.8; 37 6.6,-0.4; 38 6.6,0; 39 6.6,0.4; 40 6.6,0.8; 41 6.6,1.2; 42 6.6,1.6; 43 6.6,2; 44 6.6,2.4; 45 6.6,2.8; 46 6.6,3.2; 47 6.6,3.6; 48 6.6,4; 49 6.6,4.4; 50 6.6,4.8; 76 -6.6,4.8; 77 -6.6,4.4; 78 -6.6,4; 79 -6.6,3.6; 80 -6.6,3.2; 81 -6.6,2.8; 82 -6.6,2.4; 83 -6.6,2; 84 -6.6,1.6; 85 -6.6,1.2; 86 -6.6,0.8; 87 -6.6,0.4; 88 -6.6,0; 89 -6.6,-0.4; 90 -6.6,-0.8; 91 -6.6,-1.2; 92 -6.6,-1.6; 93 -6.6,-2; 94 -6.6,-2.4; 95 -6.6,-2.8; 96 -6.6,-3.2; 97 -6.6,-3.6; 98 -6.6,-4; 99 -6.6,-4.4; 100 -6.6,-4.8
LQFP48 = smd 1.5 x 0.3: 1 -4.15,2.75; 2 -4.15,2.25; 3 -4.15,1.75; 4 -4.15,1.25; 5 -4.15,0.75; 6 -4.15,0.25; 7 -4.15,-0.25; 8 -4.15,-0.75; 9 -4.15,-1.25; 10 -4.15,-1.75; 11 -4.15,-2.25; 12 -4.15,-2.75; 25 4.15,-2.75; 26 4.15,-2.25; 27 4.15,-1.75; 28 4.15,-1.25; 29 4.15,-0.75; 30 4.15,-0.25; 31 4.15,0.25; 32 4.15,0.75; 33 4.15,1.25; 34 4.15,1.75; 35 4.15,2.25; 36 4.15,2.75 | smd 0.3 x 1.5: 13 -2.75,-4.15; 14 -2.25,-4.15; 15 -1.75,-4.15; 16 -1.25,-4.15; 17 -0.75,-4.15; 18 -0.25,-4.15; 19 0.25,-4.15; 20 0.75,-4.15; 21 1.25,-4.15; 22 1.75,-4.15; 23 2.25,-4.15; 24 2.75,-4.15; 37 2.75,4.15; 38 2.25,4.15; 39 1.75,4.15; 40 1.25,4.15; 41 0.75,4.15; 42 0.25,4.15; 43 -0.25,4.15; 44 -0.75,4.15; 45 -1.25,4.15; 46 -1.75,4.15; 47 -2.25,4.15; 48 -2.75,4.15
AUDIO-JACK2 = drill 1.3 pad 2.184: RING 5,5; SLEEVE 0,0; TIP 5,-5 | hole 1.2: 0,5; -2.5,5; -2.5,-5; 0,-5; 5,0
1X06 = drill 1.016 long: 1 -6.35,0; 2 -3.81,0; 3 -1.27,0; 4 1.27,0; 5 3.81,0; 6 6.35,0
1X04 = drill 1.016 long: 1 -3.81,0; 2 -1.27,0; 3 1.27,0; 4 3.81,0
USB-B-MICRO-SMD_V03 = smd 1.4 x 0.4: D+1 2.7,0; D-1 2.7,0.65; GND1 2.7,-1.3; ID1 2.7,-0.65; VBUS1 2.7,1.3 | hole 0.5: 2.2,1.9; 2.2,-1.9
FB805 = smd 1.3 x 1.5: 1 -0.85,0; 2 0.85,0
R0402 = smd 0.7 x 0.9: 1 -0.65,0; 2 0.65,0
R0603 = smd 1 x 1.1: 1 -0.85,0; 2 0.85,0
R0805 = smd 1.3 x 1.5: 1 -0.95,0; 2 0.95,0
0204/7 = drill 0.813 octagon: 1 -3.81,0; 2 3.81,0
HR911105A = drill 0.813 pad 1.524: G+ 4.953,-6.604; G- 4.953,-4.064; GND -8.89,4.445; NC -6.35,3.175; P4 -8.89,-0.635; P5 -6.35,0.635; RD+ -6.35,-1.905; RD- -8.89,1.905; TD- -8.89,-3.175; Y+ 4.953,6.604; Y- 4.953,4.064 | drill 1.651 pad 2.159: SHIELD0 -2.921,8.001; SHIELD1 -2.921,-8.001 | drill 0.813 pad 1.524 square: TD+ -6.35,-4.445 | hole 3.556: 0,-5.715; 0,5.715
ML34L = drill 0.914 pad 1.676 octagon: 1 -20.32,-1.27; 2 -20.32,1.27; 3 -17.78,-1.27; 4 -17.78,1.27; 5 -15.24,-1.27; 6 -15.24,1.27; 7 -12.7,-1.27; 8 -12.7,1.27; 9 -10.16,-1.27; 10 -10.16,1.27; 11 -7.62,-1.27; 12 -7.62,1.27; 13 -5.08,-1.27; 14 -5.08,1.27; 15 -2.54,-1.27; 16 -2.54,1.27; 17 0,-1.27; 18 0,1.27; 19 2.54,-1.27; 20 2.54,1.27; 21 5.08,-1.27; 22 5.08,1.27; 23 7.62,-1.27; 24 7.62,1.27; 25 10.16,-1.27; 26 10.16,1.27; 27 12.7,-1.27; 28 12.7,1.27; 29 15.24,-1.27; 30 15.24,1.27; 31 17.78,-1.27; 32 17.78,1.27; 33 20.32,-1.27; 34 20.32,1.27
USD-SOCKET-PP = smd 0.75 x 1.5: 1 3.2,14.3; 2 2.1,14.3; 3 1,14.3; 4 -0.1,14.3; 5 -1.2,14.3; 6 -2.3,14.3; 7 -3.4,14.3; 8 -4.5,14.3 | smd 1 x 1.3: CD1 -5.85,14.25 | smd 1.4 x 1: CD2 7.275,14.1 | smd 1.5 x 1.35: GND1 -6.775,4; GND2 7.875,4
LQFP48' = smd 0.25 x 1: 1 -2.75,-4.25; 2 -2.25,-4.25; 3 -1.75,-4.25; 4 -1.25,-4.25; 5 -0.75,-4.25; 6 -0.25,-4.25; 7 0.25,-4.25; 8 0.75,-4.25; 9 1.25,-4.25; 10 1.75,-4.25; 11 2.25,-4.25; 12 2.75,-4.25; 25 2.75,4.25; 26 2.25,4.25; 27 1.75,4.25; 28 1.25,4.25; 29 0.75,4.25; 30 0.25,4.25; 31 -0.25,4.25; 32 -0.75,4.25; 33 -1.25,4.25; 34 -1.75,4.25; 35 -2.25,4.25; 36 -2.75,4.25 | smd 1 x 0.25: 13 4.25,-2.75; 14 4.25,-2.25; 15 4.25,-1.75; 16 4.25,-1.25; 17 4.25,-0.75; 18 4.25,-0.25; 19 4.25,0.25; 20 4.25,0.75; 21 4.25,1.25; 22 4.25,1.75; 23 4.25,2.25; 24 4.25,2.75; 37 -4.25,2.75; 38 -4.25,2.25; 39 -4.25,1.75; 40 -4.25,1.25; 41 -4.25,0.75; 42 -4.25,0.25; 43 -4.25,-0.25; 44 -4.25,-0.75; 45 -4.25,-1.25; 46 -4.25,-1.75; 47 -4.25,-2.25; 48 -4.25,-2.75
ASE = smd 0.9 x 0.65: 1 -1.05,-0.825; 2 1.05,-0.825; 3 1.05,0.825; 4 -1.05,0.825
SO-08M = smd 0.6 x 2.2: 1 -1.905,-3.33; 2 -0.635,-3.33; 3 0.635,-3.33; 4 1.905,-3.33; 5 1.905,3.33; 6 0.635,3.33; 7 -0.635,3.33; 8 -1.905,3.33
3.2X1.5-2-PAD = smd 1.1 x 1.9: 1 -1.25,0; 2 1.25,0
KUSBVX = drill 0.9 pad 1.524: 1 3.5,0; 2 1,0; 3 -1,0; 4 -3.5,0 | drill 2.3 pad 2.8: M1 -6.57,2.71; M2 6.57,2.71
CRYSTAL-SMD-5X3.2-4PAD = smd 1.9 x 1.1: 1 -1.85,-1.15; 2 1.85,-1.15; 3 1.85,1.15; 4 -1.85,1.15

### Placement (x,y rotation side)
C1  49.87,19 180 top
C2  26.13,25.5 0 top
C3  46.05,29.16 225 top
C4  48.99,27.89 180 top
C5  38.89,4.95 180 top
C6  64.03,37.6 315 top
C7  40.45,33.4 270 top
C8  36.94,38.58 225 top
C9  41.63,43.39 90 top
C10  62.64,36.85 315 top
C11  56.69,45.53 270 top
C12  44.91,60.53 180 top
C13  52.02,59.66 270 top
C14  52.02,63.68 90 top
C15  66.67,61.34 270 top
C16  28.05,43.98 0 top
C17  18.03,46.96 180 top
C18  18.73,40.13 180 top
C19  13.61,37.91 90 top
C20  59.13,27.97 180 top
C21  14.47,40.03 180 top
C22  5.92,27.28 180 top
C23  59.13,30.47 180 top
C24  14.3,27.65 180 top
C25  9.09,31.55 90 top
C26  16.48,11.68 180 top
C27  43.07,11.02 0 top
C28  49.45,52.29 180 top
C29  20.5,16.41 180 bottom
C30  97.18,15.16 180 top
C31  17.14,14.67 180 top
C32  11.94,38.73 90 top
C33  97.64,49.95 0 top
C34  92.05,49.95 0 top
C35  88.44,49.95 180 top
C36  92.05,56.78 270 top
C37  97.64,53.04 180 top
C38  48.19,47.71 180 top
C39  85.19,52.98 0 top
C40  82.9,43.8 90 top
C41  89.26,36.25 0 top
C42  92.56,36.25 0 top
C43  88.44,56.13 0 top
C44  96.44,56.12 180 top
C45  84.12,44.3 90 top
C46  81.46,41.15 270 top
C47  101.04,42.07 270 top
C48  96.27,37.26 0 top
C49  87.51,30.23 180 top
C50  94.37,30.23 0 top
C51  79.98,64.74 90 top
C52  66.67,53.92 270 top
C53  71.17,54.03 270 top
C54  71.17,59.13 90 top
C55  24.31,55.83 90 top
C56  86.39,35.03 270 top
C57  103.02,42.07 270 top
C58  100.33,49.12 90 top
C59  27.7,49.02 0 top
F1  48.92,61.93 270 top
IC1  45.72,16.66 0 top
IC2  57.61,62.83 270 top
IC3  50.29,39.29 180 top
IC4  19.33,31.8 180 top
IC5  76.89,57.73 270 top
JP1  92.96,64.8 270 top
JP2  47.14,54.78 0 bottom
JP3  36.6,26.06 270 bottom
JP5  45.09,67.94 270 top
L1  91.44,44.83 0 bottom
L2  85.09,47.22 180 top
L3  11.94,38.43 180 bottom
R1  8.69,36.42 270 top
R2  18.85,43.81 180 top
R3  20.11,45.39 180 top
R4  23.5,42.39 0 top
R5  24.74,43.98 0 top
R6  14.33,35.95 180 top
R7  15.77,41.38 180 top
R8  16.05,9.8 270 bottom
R9  54.33,52.28 0 top
R10  15.77,42.77 180 top
R11  16.21,17.58 270 bottom
R12  41.35,25.15 180 top
R13  19.43,6.99 180 top
R14  41.15,22.63 180 top
R15  11.94,31.55 90 top
R18  43.18,46.99 270 top
R19  24.08,27.55 270 top
R20  16.38,25.68 0 top
R21  83.46,50.39 0 top
R22  88.44,52.98 0 top
R23  92.05,52.48 270 top
R24  95.96,51.46 180 top
R25  88.44,51.46 0 top
R26  98.9,44.8 90 top
R27  97.64,45.3 90 top
R28  84.25,40.55 270 top
R29  85.47,40.05 270 top
R30  101.02,40.42 180 bottom
R31  88.44,54.56 0 top
R32  96.44,54.56 180 top
R33  94.77,57.63 180 top
R34  88.43,57.66 180 top
R35  90.94,30.23 0 top
R36  79.38,45.07 270 top
R42  14.17,64.64 0 top
R43  14.17,63.07 180 top
RJ1  23.67,59.69 90 bottom
SV1  80.9,10.79 180 bottom
U1  0,16.51 90 bottom
U2  VS1003  [LQFP48']  91.44,42.67 270 top
U$1  51.34,21.29 90 top
U$2  22.2,13.51 0 top
U$7  6.58,29.64 270 top
X2  55.83,29.22 90 top
X3  45.72,12.7 0 bottom
Y3  90.94,33.53 180 top

### Tracks (layer width: path | path; a pad name or v marks a point on that pad's centre or on a via)
1WIRE
  Top 0.203: IC3.66 51.49,24.48 56.13,19.84 60.83,19.84 62.36,18.31 62.36,12.83 SV1.3
3V  (via drill 0.6 pad 1.42, 0.6 pad 1.78)  (1 unrouted)
  Top 0.203: R18.1 44.57,47.94 44.91,47.6 44.91,45.06 45.24,44.73 49.09,44.73 | 54.69,44.73 IC3.2 54.69,47 55.23,47.53 v56.69,47.53 | 55.73,38.49 IC3.86 63.14,38.49 C6.1 | C3.1 47.09,30.2 IC3.55 47.09,33.86 | 55.73,38.49 55.73,33.86 49.89,33.86 | 49.89,27.94 IC3.62 49.89,33.86 | 49.89,27.94 49.89,21 50.52,20.38 U$1.4 50.63,20.36 | 49.09,44.73 IC3.16 49.09,47.46 C38.1 | 49.09,44.73 54.69,44.73 | 47.09,33.86 49.89,33.86 | 47.09,33.86 44.86,33.86 44.86,36.09 | 44.86,36.09 44.86,39.69 IC3.37 38.06,39.69 C8.1 | 44.86,36.09 IC3.46 41.81,36.09 40.45,34.74 C7.1 | 55.73,38.49 55.73,43.69 54.69,44.73 | 79.4,43.17 79.38,43.15 | C4.1 49.84,27.89 49.89,27.94
  Top 0.251: U2.6 83.13,42.92 C40.1 | C42.1 91.69,36.47 U2.19 91.69,39.37 89.19,39.37 U2.14 89.19,37.55 88.61,36.97 C41.1 | 89.46,22.28 89.51,22.23 | R30.2 104.83,43.16 104.04,43.94 100.25,43.94 99.73,43.42 U2.32
  Top 0.305: 78.11,43.14 78.11,43.15 | IC4.32 13.24,31.05 12.89,30.7 R15.1 | 8.77,30.7 8.76,30.7 | U$7.4 6.58,29.87 6.58,27.36 6.57,27.34 C22.1 | R19.2 22.08,26.9 IC4.48
  Top 0.406: C40.1 79.38,43.15 78.11,43.15 v76.66,43.15 | C41.1 86.36,36.25 | C56.1 86.39,36.22 86.36,36.25 | 86.36,36.25 82.73,36.25 81.99,35.51 v81.99,33.5 | R13.2 18,6.99 | R15.1 C25.1 8.76,30.7 7.41,30.7 U$7.4 | 17.98,11.44 18,11.43 | C15.+ 66.67,62.83 | C22.1 6.57,25.68 | C1.1 U$1.4 | R12.2 R14.2 40.5,20.81 38.46,18.77 v36.6,18.77
  Top 0.584: U$2.8 U$2.7
  Top 0.61: R9.2 v56.69,52.28 | C11.1 v56.69,47.53 | U$2.3 22.84,3.17 | C31.1 20.3,14.67 U$2.8 | R19.2 v24.08,25.5 C2.1 | R20.1 6.57,25.68 4.29,25.68 3,26.98 3,36.7 4.72,38.43 v8.69,38.43 R1.1 | v36.6,18.77 34.92,17.09 34.92,3.17 | R42.1 R43.2 13.32,63.01 11.88,61.57 v11.88,43.18
  Top 0.813: IC2.2 C14.1 | v18,8.95 18,11.43 C31.1 v18,16.41 v18,21.38 15.53,23.84 R20.1 | R30.2 104.83,25.83 101.22,22.23
  Top 1.016: IC2.2 IC2.TAB 60.72,62.84 63.5,62.84 v63.75,62.83 66.67,62.83 v74.12,62.83 | v18,8.95 18,6.99 18,5.5 20.32,3.17 22.84,3.17 34.92,3.17 98.42,3.17 101.22,5.97 SV1.34 SV1.33 101.22,21.97 100.97,22.23 | 100.97,22.23 89.51,22.23 83.82,22.23 81.99,24.05 v81.99,33.5 | 100.97,22.23 101.22,22.23
  Bottom 0.406: R11.2 16.19,16.73 15.88,16.41 | v18,21.38 23.28,21.38 24.08,22.17 v24.08,25.5
  Bottom 0.61: U1.4 15.88,16.41 v17.99,16.41 | v17.99,16.41 v18,16.41 | R8.2 v18,8.95 | v17.99,16.41 C29.1 | v36.6,18.77 JP3.4 | v11.88,43.18 9.53,43.18 8.69,42.34 v8.69,38.43 L3.1
  Bottom 0.813: v56.69,47.53 v56.69,52.28 63.75,59.34 v63.75,62.83
  Bottom 1.016: v81.99,33.5 79.32,33.5 76.66,36.17 v76.66,43.15 76.66,60.29 v74.12,62.83
_2V6  (via drill 0.6 pad 1.42)
  Top 0.61: L2.2 v82.53,47.22
  Top 0.813: IC5.2
  Top 1.016: IC5.2 IC5.TAB | C54.1 IC5.2 | C51.+ IC5.TAB | IC5.TAB 79.98,49.76 v82.53,47.22
  Bottom 0.61: L1.2 89.28,44.83 86.89,47.22 v82.53,47.22
A3V  (via drill 0.6 pad 1.42)  (1 unrouted)
  Top 0.305: IC4.22 17.58,37.28 16.43,38.43 v15.12,38.43
  Top 0.406: R4.2 24.34,42.74 25.29,42.74 25.29,43.98 | C16.1 26.85,44.32 C59.1 | C59.1 | C59.1 26.85,51.33 26.11,52.07 24.31,52.07 | C55.1 18.53,54.98 17.86,54.3 17.86,50.16 19.26,48.77 19.26,46.79 | C17.1 19.08,46.97 19.26,46.79 | 19.26,46.79 R3.2 19.27,45.04 18.29,45.04 18.29,43.81 R2.2 15.12,43.81 R10.2 R7.2 C21.1 | v15.12,38.43 C21.1 | C21.1
  Top 0.61: R5.2 C16.1 | RJ1.P4 24.31,52.07 RJ1.P5 C55.1
  Bottom 0.61: v15.12,38.43 L3.2
AN_3V
  Top 0.203: R18.2 43.18,44.91 43.38,44.7 44.53,44.7 44.86,44.37 44.86,42.49 IC3.30 41.63,42.49 C9.1
D2_N
  Top 0.406: IC1.1 44.77,12.75 X3.2
D2_P
  Top 0.406: IC1.3 46.67,12.75 X3.3
D_N
  Top 0.203: IC1.6 44.77,17.69 45.49,18.41 45.49,27.27 47.49,29.27 IC3.56
D_P
  Top 0.203: IC1.4 46.67,17.69 45.95,18.41 45.95,27.08 47.89,29.03 IC3.57
DP_RST  (via drill 0.6 pad 1.42)
  Top 0.203: v26.54,34.75 26.54,38.18 26.14,38.58 26.14,39.5 26.8,40.16 32.87,40.16 34.47,41.76 36.88,41.76 37.74,40.89 IC3.34
  Top 0.305: IC4.29 13.65,32.55 12.72,33.48 10.97,33.48 R1.2
  Top 0.406: v5.99,35.76 8.68,35.76 R1.2
  Bottom 0.203: v5.99,35.76 9.4,35.76 11.28,33.88 25.68,33.88 v26.54,34.75
ECRSDV  (via drill 0.6 pad 1.42)
  Top 0.203: IC3.12 50.69,49.3 v51.56,50.16
  Top 0.305: IC4.40 18.08,24.92 20.52,22.48 v30.23,22.48 | v32.05,38.63 32.05,36.4 30.25,34.59 v30.23,27.48
  Bottom 0.203: v51.56,50.16 51.56,39.12 50.32,37.87 32.82,37.87 v32.05,38.63
  Bottom 0.406: v30.23,22.48 v30.23,27.48
EINT
  Top 0.305: IC4.7 22.69,32.05 22.68,32.05 22.4,32.05 22.12,31.77 22.12,29.01 22.73,28.4 24.08,28.4 R19.1
EMDC  (via drill 0.6 pad 1.42)
  Top 0.203: IC3.71 53.49,26.04 54.79,24.74 v56.06,24.74
  Top 0.305: IC4.31 6.73,31.55 5.99,32.28 v5.99,33.96
  Bottom 0.203: v56.06,24.74 53.37,24.74 52.81,25.3 52.81,34.47 51.44,35.84 39.32,35.84 36.32,32.84 30.99,32.84 30.45,33.38 11.07,33.38 9.37,35.08 7.11,35.08 v5.99,33.96
EMDIO  (via drill 0.6 pad 1.42)
  Top 0.203: IC3.68 52.29,25.1 55.4,22 v56.69,22
  Top 0.305: IC4.30 13.24,32.05 12.89,32.4 R15.2 11.19,32.4 9.63,33.96 v8.53,33.96
  Bottom 0.203: v8.53,33.96 9.63,33.96 10.72,32.87 30.25,32.87 30.79,32.33 36.52,32.33 39.52,35.33 51.21,35.33 52.29,34.25 52.29,25.1 55.4,22 v56.69,22
EREFCLK  (via drill 0.6 pad 1.42)
  Top 0.203: IC3.14 49.89,49.3 v49.02,50.16
  Top 0.305: U$7.3 7.4,28.71 8.18,29.49 v10.52,29.49 13.44,29.49 14,30.05 IC4.34 | v27.08,31.75 27.71,32.38 27.71,36.27 27.25,36.73 v27.25,39.04
  Bottom 0.203: v49.02,50.16 49.02,39.6 47.8,38.38 33.88,38.38 32.51,39.75 27.96,39.75 v27.25,39.04 | v10.52,29.49 24.82,29.49 v27.08,31.75
ERXD0  (via drill 0.6 pad 1.42)
  Top 0.203: v37.13,35.23 40,38.09 IC3.41
  Top 0.305: IC4.43 19.58,25 20.98,23.6 28.85,23.6 32.05,26.8 32.05,32.64 32.61,33.2 v32.61,35.23
  Bottom 0.406: v37.13,35.23 v32.61,35.23
ERXD1  (via drill 0.6 pad 1.42)
  Top 0.203: v35.89,33.96 37.44,33.96 41.17,37.69 IC3.42
  Top 0.305: IC4.44 20.08,25.36 21.23,24.21 28.6,24.21 31.45,27.05 v31.45,33.96
  Bottom 0.406: v31.45,33.96 v35.89,33.96
ERXERR
  Top 0.203: IC4.41 18.58,25.21 20.75,23.04 29.08,23.04 32.61,26.57 32.61,32.41 33.73,33.53 33.73,40.31 34.67,41.25 36.68,41.25 37.43,40.49 IC3.35
ETXD0  (via drill 0.6 pad 1.42)
  Top 0.203: IC3.88 66.29,39.29 67.41,38.18 v67.41,36.85
  Top 0.305: IC4.3 27.92,30.05 29.03,31.17 v29.03,37.47
  Bottom 0.203: v67.41,36.85 31.42,36.85 30.81,37.47 v29.03,37.47
ETXD1  (via drill 0.6 pad 1.42)
  Top 0.203: IC3.87 65.09,38.89 v66.02,37.97
  Top 0.305: IC4.4 27.55,30.55 28.32,31.32 28.32,36.52 27.86,36.98 27.86,37.97 28.52,38.63 v30.33,38.63
  Bottom 0.203: v66.02,37.97 65.41,37.36 31.6,37.36 v30.33,38.63
ETXEN  (via drill 0.6 pad 1.42)
  Top 0.203: IC3.83 60.19,37.29 63.93,33.55 v64.85,33.55
  Top 0.305: IC4.2 28.28,29.55 29.64,30.91 29.64,35.64 v30.35,36.35
  Bottom 0.203: v30.35,36.35 62.05,36.35 v64.85,33.55
FLASH_CS  (1 unrouted)
  Top 0.203: IC3.38 38.91,39.29 34.24,34.62 34.24,33.33 33.12,32.21 33.12,21.67 31.57,20.12 23.95,20.12 22.2,18.36 22.2,14.25 20.3,12.34 U$2.1
  Top 0.61: U$2.1 20.3,6.99
GND  (via drill 0.5 pad 1.27, 0.5 pad 1.42, 0.6 pad 1.42, 0.61 pad 1.42)
  Top 0.198: IC3.75 v57.33,32.69
  Top 0.203: IC3.65 51.09,24.07 52.17,22.99 U$1.2 | IC3.15 49.49,48.35 48.88,48.96 v47.47,48.96 | IC3.31 v40.13,42.09 | v36.22,40.09 IC3.36 46.76,40.09 | IC3.45 41.4,36.49 39.6,34.7 39.6,32.75 C7.2
  Top 0.251: U2.4 85.67,43.92 84.62,44.95 C45.2 | U2.20 92.19,39.37 92.66,39.37 | 92.66,39.37 93.19,39.37 U2.22 93.19,36.27 C42.2 | U2.21 92.69,39.34 92.66,39.37 | U2.16 90.19,37.48 89.91,37.2 C41.2
  Top 0.254: IC1.2 45.89,14.36 45.89,15.19 46.17,15.47 48.26,15.47
  Top 0.305: v21.82,39.85 21.82,38.66 21.08,37.92 IC4.15 21.08,33.14 | IC4.19 19.08,38.38 18.08,39.38 C18.2 | IC4.35 14.36,29.55 13.54,28.73 | IC4.47 v21.58,25.5 | IC4.6 24.59,31.55 25.26,32.22 v25.26,36.02
  Top 0.406: JP5.GND1 v43.78,63.01
  other vias: 44.35,27.13 53.77,20.52 67.41,34.7 24.38,7.9 52.02,66.42 48.69,26.52 58.47,45.24 61.75,27.91 79.96,40.41 81.27,44.56 86.82,38.66 94.84,32.38 86.84,32.38 100.43,46.18 76.89,65.15 66.67,58.17 69.27,49.91 102.34,38.07 18.62,41.81 11.88,41.05 12.09,35.99 12.06,27.65 25.55,46.56 7.24,32.74 4.42,28.92 15.36,46.56 28.72,46.56 27.3,15.06 13.07,5.74 27.29,27.48 20.94,19.91 59.57,24.74 38.09,7.72 56.95,15.72 4.82,50.19
  pour Top (isolate 0.305, rank 2, no thermals): 0,0 0,68.58 109.86,68.58 109.86,0
  pour Bottom (isolate 0.305, no thermals): 0,68.58 0,0 109.86,0 109.86,68.58
LED
  Top 0.203: IC3.67 51.89,24.79 56.34,20.34 61.04,20.34 62.87,18.52 62.87,14.12 64.39,12.6 64.39,10.79 SV1.6
LED_ACT
  Top 0.305: RJ1.G- 18.36,65.89 12.22,65.89 10.52,64.19 10.52,35.84 11.67,34.69 13.22,34.69 13.85,34.05 IC4.26
LED_LINK
  Top 0.305: IC4.28 14,33.05 12.96,34.09 11.4,34.09 9.91,35.59 9.91,64.44 11.96,66.5 20.14,66.5 22,64.64 RJ1.Y-
MCLR
  Top 0.203: IC3.13 C28.1
  Top 0.406: C28.1 R9.1 53.48,54.76 JP2.1
MISO  (via drill 0.6 pad 1.42)
  Top 0.203: IC3.49 42.64,34.89 42.34,34.59 42.34,30.23 38.53,26.42 38.53,21.74 37.72,20.93 34.52,20.93 30.94,17.35 26.64,17.35 25.53,18.47 23.77,18.47 23.47,18.16 23.47,14.61 23.82,14.25 26.44,14.25 27.3,13.39 v27.3,11.89
  Top 0.305: v27.3,11.89 21.85,11.89 21.57,11.61 U$2.2
  Bottom 0.406: U1.7 16.18,13.11 17.39,11.89 v27.3,11.89
MOSI  (via drill 0.6 pad 1.42)
  Top 0.203: v25.58,16.84 31.14,16.84 34.72,20.42 37.92,20.42 39.04,21.54 39.04,26.21 43.69,30.86 IC3.50
  Top 0.584: v25.58,16.84 U$2.5
  Bottom 0.305: U1.3 14.37,17.58 24.84,17.58 v25.58,16.84
N$1
  Top 0.305: IC4.21 18.08,37.65 16.42,39.3 R7.1
N$3
  Top 0.305: IC4.24 R6.1
N$4
  cutout Top: 44.07,42.44 44.07,39.37 45.26,39.37 45.26,42.44
N$6
  Top 0.305: IC4.20 18.58,38.01 17.14,39.45 17.14,42.05 R10.1
N$7
  cutout Top: 16.51,27.99 16.51,29.72 15.93,29.72 15.93,27.99
N$8  (via drill 0.6 pad 1.27)
  other vias: 104.86,18.97
N$9  (via drill 0.6 pad 1.27)
  other vias: 104.86,63.58
N$10
  Top 0.203: IC3.85 61.39,38.09 C10.1
N$11  (via drill 0.6 pad 1.27)
  other vias: 5,63.58
N$12
  Top 0.61: R42.2 RJ1.G+
N$17
  Top 0.406: JP5.VBUS1 46.38,63.9 46.96,63.33 F1.1
N$18
  Top 0.406: C36.2 R23.1
N$19
  Top 0.406: R43.1 28.7,63.07 RJ1.Y+
N$36  (via drill 0.6 pad 1.27)
  other vias: 5,5
PGEC
  Top 0.203: IC3.24 45.89,48.22 43.33,50.77 JP2.5
PGED
  Top 0.203: IC3.25 45.49,47.9 42.06,51.33 42.06,55.93 42.85,56.72 44.83,56.72 45.87,55.68 JP2.4
PH0
  Top 0.203: IC3.63 50.29,22.56 U$1.3
RA6
  Top 0.203: IC3.91 67.23,40.49 73.28,34.44 73.28,19.68 SV1.17
RA7
  Top 0.203: IC3.92 67.54,40.89 73.79,34.65 73.79,19.89 80.37,13.31 81.46,13.31 82.17,12.6 82.17,10.79 SV1.20
RC15
  Top 0.203: IC3.64 50.69,23.5 51.33,22.86 51.33,19.58 51.59,19.33 60.63,19.33 61.85,18.11 61.85,10.79 SV1.4
RD1
  Top 0.203: SV1.7 68.2,24.31 58.01,34.49 IC3.76
RD2
  Top 0.203: SV1.10 69.47,10.79 69.47,12.62 68.71,13.39 68.71,24.51 58.32,34.89 IC3.77
RD3
  Top 0.203: IC3.78 58.63,35.29 69.22,24.71 69.22,13.59 SV1.9
RD4
  Top 0.203: IC3.81 59.57,36.49 70.74,25.32 70.74,16.43 74.55,12.62 74.55,10.79 SV1.14
RD5
  Top 0.203: IC3.82 59.88,36.89 71.25,25.53 71.25,16.64 SV1.13
RD7
  Top 0.203: IC3.84 60.5,37.69 63.52,34.67 65.3,34.67 65.96,34.01 65.96,31.52 71.75,25.73 71.75,17.93 77.09,12.6 77.09,10.79 SV1.16
RD9
  Top 0.203: IC3.69 52.69,25.41 54.99,23.11 57.15,23.11 57.81,22.45 57.81,21.44 58.4,20.85 61.24,20.85 63.37,18.72 63.37,14.35 SV1.5
RD12
  Top 0.203: IC3.79 58.95,35.69 69.72,24.92 69.72,14.91 72.01,12.62 72.01,10.79 SV1.12
RD13
  Top 0.203: IC3.80 59.26,36.09 70.23,25.12 70.23,15.11 SV1.11
RD_N
  Top 0.254: 23.5,43.89 23.5,38.84 22.08,37.43 IC4.13 | 23.5,43.89 23.5,45.11 arc-90 23.88,45.49 23.99,45.49 arc90 24.37,45.87 24.37,45.88 arc90 23.99,46.27 23.88,46.27 arc-90 23.5,46.65 23.5,46.66 arc-90 23.88,47.04 23.99,47.04 arc90 24.37,47.42 24.37,47.43 arc90 23.99,47.81 23.88,47.81 arc-90 23.5,48.19 23.5,48.72 RJ1.RD- | R5.1 23.58,43.98 23.5,43.89
RD_P
  Top 0.254: 23.04,42.44 23.04,48.97 21.77,50.24 RJ1.RD+ | IC4.14 21.58,37.57 23.04,39.03 23.04,42.44 | R4.1 22.99,42.39 23.04,42.44
RE0
  Top 0.203: IC3.93 67.85,41.29 70.13,39.01 70.56,38.58 74.3,34.85 74.3,20.09 80.57,13.82 81.69,13.82 SV1.19
RE1
  Top 0.203: IC3.94 68.16,41.69 74.8,35.05 74.8,20.3 80.77,14.33 81.89,14.33 82.91,13.31 84,13.31 84.71,12.6 84.71,10.79 SV1.22
RE2
  Top 0.203: IC3.98 69.41,43.29 76.83,35.87 76.83,21.11 81.58,16.36 82.7,16.36 83.72,15.34 84.84,15.34 85.85,14.33 86.97,14.33 87.99,13.31 89.08,13.31 89.79,12.6 89.79,10.79 SV1.26
RE3
  Top 0.203: IC3.99 69.72,43.69 77.34,36.07 77.34,21.31 81.79,16.87 82.91,16.87 83.92,15.85 85.04,15.85 86.06,14.83 87.17,14.83 88.19,13.82 89.31,13.82 SV1.25
RE4
  Top 0.203: IC3.100 70.03,44.09 77.85,36.27 77.85,21.51 81.99,17.37 83.11,17.37 84.12,16.36 85.24,16.36 86.26,15.34 87.38,15.34 88.39,14.33 89.51,14.33 90.53,13.31 91.62,13.31 92.33,12.6 92.33,10.79 SV1.28
RE5
  Top 0.203: IC3.3 54.29,47.59 55.35,48.64 58.57,48.64 62.61,44.6 70.23,44.6 78.36,36.47 78.36,21.72 82.19,17.88 83.31,17.88 84.33,16.87 85.45,16.87 86.46,15.85 87.58,15.85 88.59,14.83 89.71,14.83 90.73,13.82 91.85,13.82 SV1.27
REG_OUT
  Top 0.305: 17.08,34.65 IC4.23 17.08,36.92 16.74,37.26 C19.1 | 17.08,34.65 19.58,34.65 IC4.18 19.58,40.13 C18.1 | 17.08,34.65 16.58,34.15 IC4.37 C24.1
  Top 0.406: C19.1 12.57,37.25 C32.1
RG0
  Top 0.203: IC3.90 66.92,40.09 72.77,34.24 72.77,19.46 79.63,12.6 79.63,10.79 SV1.18
RG1
  Top 0.203: IC3.89 66.61,39.69 72.26,34.04 72.26,18.16 SV1.15
RG12
  Top 0.203: IC3.96 68.78,42.49 75.82,35.46 75.82,20.7 81.18,15.34 82.3,15.34 83.31,14.33 84.43,14.33 85.45,13.31 86.54,13.31 87.25,12.6 87.25,10.79 SV1.24
RG13
  Top 0.203: IC3.97 69.09,42.89 76.33,35.66 76.33,20.9 81.38,15.85 82.5,15.85 83.52,14.83 84.63,14.83 85.65,13.82 86.77,13.82 SV1.23
RG14
  Top 0.203: IC3.95 68.47,42.09 71.48,39.09 71.58,38.99 75.31,35.26 75.31,20.5 80.97,14.83 82.09,14.83 83.11,13.82 84.23,13.82 SV1.21
RX_DV
  Top 0.305: IC4.39 17.58,26.03 R20.2
RXD
  Top 0.203: IC3.47 42.02,35.69 41.33,35 41.33,30.56 39.37,28.6 35.41,28.6 34.65,27.84 34.65,25.73 35.59,24.79 JP3.3
SCK  (via drill 0.6 pad 1.42)
  Top 0.203: IC3.39 39.22,38.89 34.75,34.42 34.75,33.12 33.63,32 33.63,21.46 31.77,19.61 24.18,19.61 22.84,18.26 U$2.6
  Top 0.305: U$2.6 22.84,14.25 23.95,13.13 v25.98,13.13
  Bottom 0.305: U1.5 14.37,15.24 15.85,15.24 17.96,13.13 v25.98,13.13
SCL1A
  Top 0.203: IC3.53 46.29,31.38 42.62,27.71 42.62,25.4 | SV1.1 59.33,10.82 59.33,8.99 58.57,8.23 41.73,8.23 41.05,8.91 41.05,13.18 42.62,14.76 42.62,25.4 | R12.1 42.37,25.15 42.62,25.4
SD_CS  (via drill 0.6 pad 1.42)
  Top 0.203: IC3.44 41.11,36.89 37.06,32.84 35.18,32.84 34.14,31.8 34.14,21.26 31.36,18.48 v27.1,18.48
  Bottom 0.305: U1.2 15.88,18.61 | v27.1,18.48 16.26,18.48 R11.1
  Bottom 0.406: R11.1 16.06,18.43 15.88,18.61
SD_PRESENT  (via drill 0.6 pad 1.42)
  Top 0.203: IC3.51 45.49,31.95 39.55,26.01 39.55,21.31 38.12,19.91 34.92,19.91 31.37,16.36 31.37,11.68 30.34,10.65 v25.98,10.65
  Bottom 0.305: R8.1 16.09,10.65
  Bottom 0.406: v25.98,10.65 R8.1
  Bottom 0.61: U1.CD1 R8.1
SDA1A
  Top 0.203: IC3.52 45.89,31.69 41.35,27.15 41.35,24.21 42.11,23.44 42.11,22.86 | SV1.2 58.78,7.72 41.53,7.72 40.54,8.71 40.54,13.39 42.11,14.96 42.11,22.86 | R14.1 41.88,22.63 42.11,22.86
SOSCI
  Top 0.203: IC3.73 54.29,29.1 55.42,27.97 X2.1
  Top 0.406: X2.1 C20.2
SOSCO
  Top 0.203: IC3.74 54.69,31.21 55.43,30.47 X2.2
  Top 0.406: X2.2 C23.2
TD_N
  Top 0.254: IC4.16 20.58,45.52 | 20.58,45.52 20.58,46.3 arc-90 21.01,46.74 21.24,46.74 arc90 21.68,47.17 21.68,47.18 arc90 21.24,47.61 21.01,47.61 arc-90 20.58,48.05 20.58,48.05 arc-90 21.01,48.49 21.24,48.49 arc90 21.68,48.92 21.68,48.93 arc90 21.24,49.36 21.01,49.36 arc-90 20.58,49.8 20.58,50.72 RJ1.TD- | R3.1 20.71,45.39 20.58,45.52
TD_P
  Top 0.254: IC4.17 20.08,43.61 | 20.08,43.61 20.08,49.37 19.23,50.22 RJ1.TD+ | R2.1 19.88,43.81 20.08,43.61
TXD
  Top 0.203: IC3.48 42.33,35.29 41.83,34.8 41.83,30.43 38.73,27.33 JP3.2
VBUS  (via drill 0.6 pad 1.42)
  Top 0.203: IC3.54 46.69,31.07 43.23,27.61 43.23,15.47
  Top 0.254: IC1.5 45.55,16.66 45.55,15.75 45.26,15.47 43.23,15.47
  Top 0.406: C13.1 52.06,60.52 52.07,60.52 | 43.23,15.47 43.23,13.71 X3.1
  Top 0.61: F1.2 52.07,60.52 | C30.+ 98.68,15.24
  Top 0.813: X3.1 C27.1 | C12.+ 47.66,60.53 F1.2 | 52.07,60.52 54.5,60.52 IC2.3 | IC5.3 | C53.1 71.12,55.43 | C53.1 | IC5.3 | C27.1 | v42.22,9.35 C27.1
  Top 1.016: IC2.3 56.33,60.52 61.42,55.42 C52.+ C53.1 IC5.3 | v78.31,48.46 78.31,52.55 75.44,55.42 IC5.3 | v80.47,35.46 80.47,23.04 83.19,20.32 98.68,20.32 98.68,15.24 SV1.31 SV1.32 98.68,6.48 97.16,4.95 v42.22,4.95 C5.+
  Bottom 0.813: v42.22,4.95 v42.22,9.35
  Bottom 1.016: v78.31,48.46 78.31,37.62 v80.47,35.46
VS_AGND
  Top 0.251: U2.47 89.19,47.56 87.59,49.16 C35.2 | U2.41 92.19,47.87 92.58,47.87 92.69,47.75 | U2.40 92.69,47.75 | 92.69,47.75 92.69,49.74 C34.2 | U2.37 94.19,47.58 95.38,48.77 98.17,48.77 98.49,49.09 C33.2
  Top 0.406: C35.2 R25.1 84.34,51.46 C39.1 | C37.1 C33.2 | 92.96,62.43 92.89,62.36 | 84.44,55.91 84.34,56.01 | C34.2 93.92,50.97 R33.2
  Top 0.61: 91.44,62.36 92.89,62.36 98.55,62.36 99.82,61.09 99.82,58.67 98.49,57.34 C37.1 | 91.44,62.36 85.72,62.36 84.34,60.97 84.34,57.66 | JP1.SLEEVE 92.96,62.43 | C39.1 84.34,56.01 84.34,57.66 | 91.44,62.36 91.44,59.18 92.05,58.57 C36.1 R33.2 | R34.2 84.34,57.66
  pour Top (isolate 0.305, no thermals): 83.82,68.71 83.82,49.53 101.73,49.53 101.73,60.58 100.33,61.98 100.33,68.71
VS_AVDD  (via drill 0.6 pad 1.42)
  Top 0.251: C35.1 89.29,49.16 90.19,48.27 U2.45 90.19,45.97 91.19,45.97 | C34.1 91.19,49.3 U2.43 91.19,45.97 | C33.1 95.44,49.95 93.69,48.2 U2.38 93.69,45.97 | 93.69,45.97 91.19,45.97 | 93.69,45.97 94.77,45.97 v95.63,46.84
  Top 0.406: v95.63,46.84 96.93,48.13 100.19,48.13 C58.1
  Bottom 0.61: L1.1 93.62,44.83 v95.63,46.84
VS_CVDD
  Top 0.251: C45.1 84.35,43.42 U2.5 88.21,43.42 | 88.21,43.42 88.21,45.9 | 94.19,42.42 U2.24 94.19,37.26 C48.1 | 94.19,42.42 94.69,42.92 U2.31 C47.1 | 88.21,43.42 88.21,42.42 | 88.21,42.42 94.19,42.42 | 88.21,42.42 U2.7 81.88,42.42 C46.1
  Top 0.254: 88.21,45.9 86.89,47.22 L2.1
  Top 0.61: C47.1 C57.1
VS_DREQ
  Top 0.203: U2.8 83.32,41.92 82.8,41.4 82.8,39.73 82.19,39.12 77.85,39.12 70.84,46.13 63.22,46.13 59.18,50.16 54.74,50.16 53.09,48.52 IC3.6
VS_MISO  (via drill 0.6 pad 1.42)
  Top 0.203: v74.02,47.14 63.63,47.14 59.59,51.18 54.33,51.18 51.89,48.74 IC3.9
  Top 0.251: 100.1,40.06 100.1,40.59 98.27,42.42 97.73,42.42 | 84.71,26.98 84.71,25.7 | 91.44,26.04 88.9,26.04
  Top 0.254: 97.08,42.42 U2.30 97.73,42.42 | 100.1,40.06 100.1,29.16 96.98,26.04 91.44,26.04 | v84.71,29.64 84.71,26.98 | 84.71,25.7 84.71,25.43 85.42,24.71 87.17,24.71 88.49,26.04 88.9,26.04
  Bottom 0.406: v74.02,47.14 74.02,35.43 79.81,29.64 v84.71,29.64
VS_MOSI  (via drill 0.6 pad 1.42)
  Top 0.203: IC3.72 53.89,26.35 54.38,25.86 v61.75,25.86
  Top 0.251: 99.54,39.83 99.54,40.36 97.98,41.92 97.45,41.92
  Top 0.254: U2.29 97.45,41.92 | 99.54,39.83 99.54,29.39 96.75,26.59 88.19,26.59 87.45,25.86 v85.9,25.86
  Bottom 0.406: v85.9,25.86 v61.75,25.86
VS_N$9
  Top 0.251: U2.18 91.19,34.61 | 91.19,34.61 91.19,31.77 91.79,31.17 R35.2 | Y3.1 91.26,34.68 91.19,34.61
  Top 0.61: R35.2 C50.1
VS_N$13
  Top 0.251: U2.17 90.69,32.38 | 90.69,32.38 90.69,31.74 90.09,31.14 R35.1 | Y3.3 90.69,32.38
  Top 0.254: R35.1 90.09,30.13
  Top 0.61: R35.1 C49.1
VS_N$14
  Top 0.251: U2.46 89.69,47.9 88.44,49.15 88.44,52.09 89.29,52.95 R22.2
  Top 0.406: R22.2 R31.2
VS_N$15
  Top 0.251: U2.42 91.69,48.74 92.05,49.1 R23.2
VS_N$16
  Top 0.251: U2.39 93.19,48.51 95.11,50.43 R24.2
  Top 0.406: R24.2 95.11,52.62 95.61,53.11 95.61,54.56 R32.2
VS_N$17
  Top 0.251: U2.44 90.69,48.48 90.25,48.92 90.25,51.09 89.29,51.09 R25.2
VS_N$24
  Top 0.305: 96.79,52.02 R24.1
  Top 0.406: C37.2 96.79,52.02
VS_N$25
  Top 0.406: C39.2 R22.1
VS_N$26
  Top 0.251: U2.10 86.29,40.92 85.69,40.92 R29.1
VS_N$27
  Top 0.251: U2.9 84.47,41.42 R28.1
VS_N$28
  Top 0.251: U2.34 97.41,44.42 R27.1
VS_N$30
  Top 0.251: U2.33 98.68,43.92 R26.1
VS_N$34
  Top 0.251: U2.26 R30.1
VS_N$35
  Top 0.406: R31.1 C43.1
VS_N$36
  Top 0.406: R32.1 C44.1
VS_N$37
  Top 0.61: JP1.RING 96.5,59.8 95.62,58.91 R33.1 95.59,57.61 C44.2
VS_N$38
  Top 0.406: C43.2 89.29,57.65 R34.1
  Top 0.61: 89.29,57.65 89.29,58.79 88.29,59.8 JP1.TIP
VS_SCK  (via drill 0.6 pad 1.42)
  Top 0.203: IC3.70 53.09,25.72 55.19,23.62 61.95,23.62 v62.97,24.64
  Top 0.251: 98.98,39.6 98.98,40.13 97.69,41.42 97.16,41.42 | 90.91,27.15 v87.12,27.15
  Top 0.254: U2.28 97.16,41.42 | 98.98,39.6 98.98,29.62 96.52,27.15 90.91,27.15
  Bottom 0.406: v87.12,27.15 87.12,25.35 86.41,24.64 v62.97,24.64
VS_XCS
  Top 0.203: 88.11,39.37 88.11,38.05 87.4,37.34 78.92,37.34 70.64,45.62 63.02,45.62 58.98,49.66 54.94,49.66 53.49,48.21 IC3.5
  Top 0.254: U2.23 93.69,39.76 93.42,40.03 88.77,40.03 88.11,39.37
VS_XDCS
  Top 0.203: 88.69,37.84 87.68,36.83 78.72,36.83 70.43,45.11 62.81,45.11 58.78,49.15 55.14,49.15 53.89,47.9 IC3.4
  Top 0.254: U2.13 88.69,37.84
VS_XRST
  Top 0.203: IC3.7 52.69,48.83 54.53,50.67 59.38,50.67 63.42,46.63 72.95,46.63 73.74,45.85 79.3,45.85 R36.1 79.38,45.82 84.71,45.82 86.08,44.45 87.16,44.45 U2.3